# Altium project OZ440-SE100-CAR003.PrjPcb (part 1 of 3)
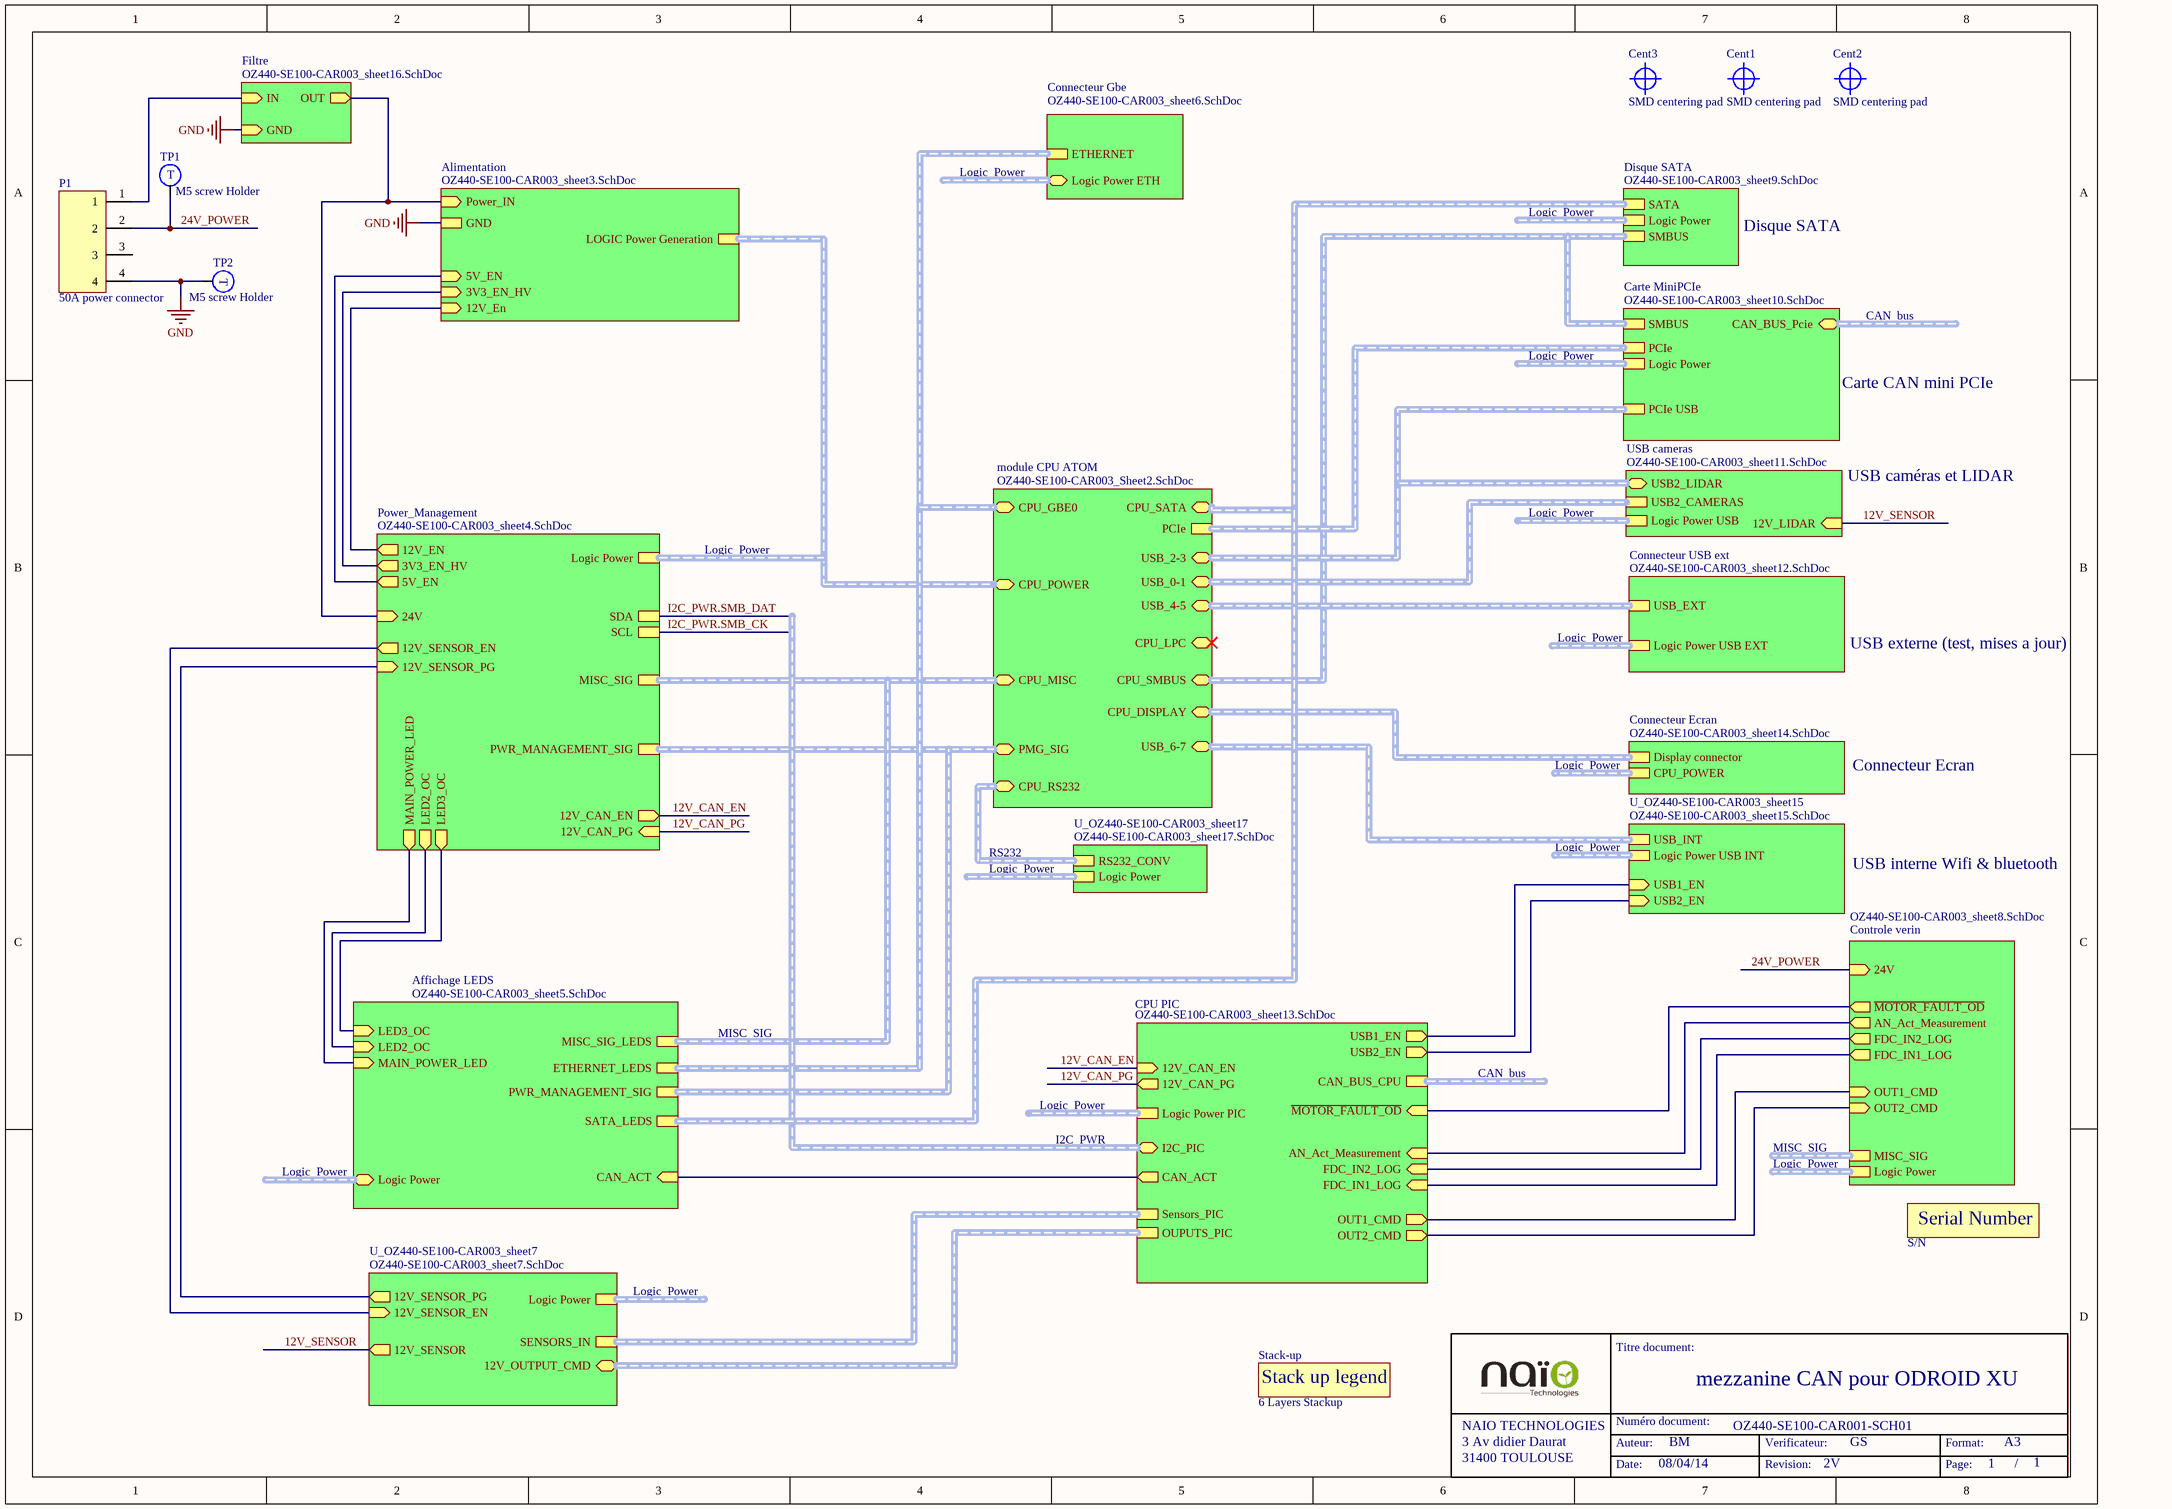
[diagram p0: OZ440-SE100-CAR003_Sheet1.SchDoc]
AssyDocumentNumber: OZ440-SE100-CAR003-Asb01; BoardName: Carte Mere OZ440; BoardPartNumber: OZ440-SE100-CAR003_2V; BoardRevision: 2V; DesignEngineer: Bruno M; DrillDocumentNumber: OZ440-SE100-CAR003-DRL01; ProjectTitle: Carte Mere OZ440; VerifEngineer: Pascal S
17 sheets, 326 parts. Net scope: strictly hierarchical (ports join the sheet entries above them; power ports are local).
Board file: OZ440-SE100-CAR003.PcbDoc
Sheets:
  OZ440-SE100-CAR003_Sheet1.SchDoc
    module CPU ATOM = OZ440-SE100-CAR003_Sheet2.SchDoc
    Alimentation = OZ440-SE100-CAR003_sheet3.SchDoc
    Power_Management = OZ440-SE100-CAR003_sheet4.SchDoc
    Affichage LEDS = OZ440-SE100-CAR003_sheet5.SchDoc
    Connecteur Gbe = OZ440-SE100-CAR003_sheet6.SchDoc
    U_OZ440-SE100-CAR003_sheet7 = OZ440-SE100-CAR003_sheet7.SchDoc
    Controle verin = OZ440-SE100-CAR003_sheet8.SchDoc
    Disque SATA = OZ440-SE100-CAR003_sheet9.SchDoc
    Carte MiniPCIe = OZ440-SE100-CAR003_sheet10.SchDoc
    USB cameras = OZ440-SE100-CAR003_sheet11.SchDoc
    Connecteur USB ext = OZ440-SE100-CAR003_sheet12.SchDoc
    CPU PIC = OZ440-SE100-CAR003_sheet13.SchDoc
    Connecteur Ecran = OZ440-SE100-CAR003_sheet14.SchDoc
    U_OZ440-SE100-CAR003_sheet15 = OZ440-SE100-CAR003_sheet15.SchDoc
    Filtre = OZ440-SE100-CAR003_sheet16.SchDoc
    U_OZ440-SE100-CAR003_sheet17 = OZ440-SE100-CAR003_sheet17.SchDoc

## Sheet OZ440-SE100-CAR003_Sheet1.SchDoc: mezzanine CAN pour ODROID XU
size A3; Date: 08/04/14; CheckedBy: GS; Author: BM; DocumentNumber: OZ440-SE100-CAR001-SCH01; Revision: 2V; SheetNumber: 1; SheetTotal: 1

### Parts
Cent1  MEC-STD-CENTER  [MEC-STD-CENTER]  (value not drawn)  (no BOM)
Cent2  MEC-STD-CENTER  [MEC-STD-CENTER]  (value not drawn)  (no BOM)
Cent3  MEC-STD-CENTER  [MEC-STD-CENTER]  (value not drawn)  (no BOM)
P1  Displayed reference: 50A power connector  [CONN-SPE-428204213_MOLEX]  (hidden comment: CONN-STD-4P_puissance)
SN1  Displayed reference: S/N  [SERIAL_NUMBER-STD]  (hidden comment: SERIAL-NUMBER)
Stack-up  Displayed reference: 6 Layers Stackup  [STACKUP-SPE-6LAYERS]  (hidden comment: STACKUP)  (no BOM)
TP1  Displayed reference: M5 screw Holder  [MEC-SPE-WURTHZ_7460408]  (hidden comment: TP-STD-TEST_POINT)
TP2  Displayed reference: M5 screw Holder  [MEC-SPE-WURTHZ_7460408]  (hidden comment: TP-STD-TEST_POINT)

### Sub-sheets
Affichage LEDS = OZ440-SE100-CAR003_sheet5.SchDoc: SATA_LEDS (harness SATA), ETHERNET_LEDS (harness ETHERNET), MISC_SIG_LEDS (harness MISC_SIG), MAIN_POWER_LED (in), PWR_MANAGEMENT_SIG (harness PWR_MANAGEMENT_SIG), CAN_ACT (in), LED2_OC (in), LED3_OC (in), Logic Power (harness Logic Power)
Alimentation = OZ440-SE100-CAR003_sheet3.SchDoc: Power_IN (in), 12V_En (in), GND, 5V_EN (in), LOGIC Power Generation (harness Logic Power), 3V3_EN_HV (in)
Carte MiniPCIe = OZ440-SE100-CAR003_sheet10.SchDoc: PCIe (harness PCIe), Logic Power (harness Logic Power), SMBUS (harness SMBUS), PCIe USB (harness USB2_DUAL), CAN_BUS_Pcie (harness CAN_BUS)
Connecteur Ecran = OZ440-SE100-CAR003_sheet14.SchDoc: Display connector (harness Display), CPU_POWER (harness Logic Power)
Connecteur Gbe = OZ440-SE100-CAR003_sheet6.SchDoc: ETHERNET (harness ETHERNET), Logic Power ETH (harness Logic Power)
Connecteur USB ext = OZ440-SE100-CAR003_sheet12.SchDoc: USB_EXT (harness USB2_DUAL), Logic Power USB EXT (harness Logic Power)
Controle verin = OZ440-SE100-CAR003_sheet8.SchDoc: 24V (in), OUT1_CMD (in), OUT2_CMD (in), MISC_SIG (harness MISC_SIG), ~{MOTOR_FAULT_OD} (out), Logic Power (harness Logic Power), AN_Act_Measurement (out), FDC_IN2_LOG (out), FDC_IN1_LOG (out)
CPU PIC = OZ440-SE100-CAR003_sheet13.SchDoc: CAN_BUS_CPU (harness CAN_BUS), Logic Power PIC (harness Logic Power), OUPUTS_PIC (harness OUPUTS), Sensors_PIC (harness Sensors), OUT1_CMD (out), OUT2_CMD (out), AN_Act_Measurement (in), FDC_IN2_LOG (in), FDC_IN1_LOG (in), ~{MOTOR_FAULT_OD} (in), I2C_PIC (harness SMBUS), CAN_ACT (out), 12V_CAN_EN (in), 12V_CAN_PG (out), USB1_EN (out), USB2_EN (out)
Disque SATA = OZ440-SE100-CAR003_sheet9.SchDoc: SATA (harness SATA), Logic Power (harness Logic Power), SMBUS (harness SMBUS)
Filtre = OZ440-SE100-CAR003_sheet16.SchDoc: IN (in), OUT (out), GND (in)
module CPU ATOM = OZ440-SE100-CAR003_Sheet2.SchDoc: PCIe (harness PCIe), CPU_POWER (harness Logic Power), CPU_DISPLAY (harness Display), CPU_GBE0 (harness ETHERNET), USB_0-1 (harness USB2_DUAL), USB_2-3 (harness USB2_DUAL), CPU_SATA (harness SATA), CPU_LPC (harness LPC_BUS), PMG_SIG (harness PWR_MANAGEMENT_SIG), CPU_MISC (harness MISC_SIG), CPU_RS232 (harness RS232), CPU_SMBUS (harness SMBUS), USB_4-5 (harness USB2_DUAL), USB_6-7 (harness USB2_DUAL)
Power_Management = OZ440-SE100-CAR003_sheet4.SchDoc: Logic Power (harness Logic Power), SCL, SDA, 24V (in), PWR_MANAGEMENT_SIG (harness PWR_MANAGEMENT_SIG), MISC_SIG (harness MISC_SIG), 3V3_EN_HV (out), 12V_EN (out), 5V_EN (out), 12V_SENSOR_EN (out), 12V_CAN_EN (out), MAIN_POWER_LED (out), LED2_OC (out), LED3_OC (out), 12V_SENSOR_PG (in), 12V_CAN_PG (in)
U_OZ440-SE100-CAR003_sheet7 = OZ440-SE100-CAR003_sheet7.SchDoc: Logic Power (harness Logic Power), 12V_SENSOR_EN (in), 12V_SENSOR_PG (out), SENSORS_IN (harness Sensors), 12V_OUTPUT_CMD (harness OUPUTS), 12V_SENSOR (out)
U_OZ440-SE100-CAR003_sheet15 = OZ440-SE100-CAR003_sheet15.SchDoc: USB_INT (harness USB2_DUAL), Logic Power USB INT (harness Logic Power), USB1_EN (in), USB2_EN (in)
U_OZ440-SE100-CAR003_sheet17 = OZ440-SE100-CAR003_sheet17.SchDoc: RS232_CONV (harness RS232), Logic Power (harness Logic Power)
USB cameras = OZ440-SE100-CAR003_sheet11.SchDoc: Logic Power USB (harness Logic Power), USB2_CAMERAS (harness USB2_DUAL), USB2_LIDAR (harness USB2_DUAL), 12V_LIDAR (in)

### Nets
12V_SENSOR: sheet U_OZ440-SE100-CAR003_sheet7/12V_SENSOR, sheet USB cameras/12V_LIDAR
GND: P1.4 TP2.1(T) ; sheet Alimentation/GND, sheet Filtre/GND  [project net Logic_Power.GND]
5V_EN: sheet Alimentation/5V_EN, sheet Power_Management/5V_EN
12V_CAN_EN: sheet Power_Management/12V_CAN_EN, sheet CPU PIC/12V_CAN_EN
12V_CAN_PG: sheet Power_Management/12V_CAN_PG, sheet CPU PIC/12V_CAN_PG
12V_EN: sheet Alimentation/12V_En, sheet Power_Management/12V_EN
12V_SENSOR_EN: sheet Power_Management/12V_SENSOR_EN, sheet U_OZ440-SE100-CAR003_sheet7/12V_SENSOR_EN
24V_POWER: P1.2 TP1.1(T) ; sheet Controle verin/24V
~{MOTOR_FAULT_OD}: sheet Controle verin/~{MOTOR_FAULT_OD}, sheet CPU PIC/~{MOTOR_FAULT_OD}
CAN_ACT: sheet Affichage LEDS/CAN_ACT, sheet CPU PIC/CAN_ACT
LED2_OC: sheet Power_Management/LED2_OC, sheet Affichage LEDS/LED2_OC
LED3_OC: sheet Power_Management/LED3_OC, sheet Affichage LEDS/LED3_OC
MAIN_POWER_LED: sheet Power_Management/MAIN_POWER_LED, sheet Affichage LEDS/MAIN_POWER_LED
POWER_IN: sheet Alimentation/Power_IN, sheet Power_Management/24V, sheet Filtre/OUT
NetC51_2: sheet Controle verin/AN_Act_Measurement, sheet CPU PIC/AN_Act_Measurement
NetC52_2: sheet Controle verin/FDC_IN1_LOG, sheet CPU PIC/FDC_IN1_LOG
NetC53_2: sheet Controle verin/FDC_IN2_LOG, sheet CPU PIC/FDC_IN2_LOG
NetF6_1: P1.1 ; sheet Filtre/IN
NetQ1_4: sheet Alimentation/3V3_EN_HV, sheet Power_Management/3V3_EN_HV
NetQ28_1: sheet CPU PIC/USB1_EN, sheet U_OZ440-SE100-CAR003_sheet15/USB1_EN
NetQ29_1: sheet CPU PIC/USB2_EN, sheet U_OZ440-SE100-CAR003_sheet15/USB2_EN
NetR42_2: sheet Power_Management/12V_SENSOR_PG, sheet U_OZ440-SE100-CAR003_sheet7/12V_SENSOR_PG
NetR83_1: sheet Controle verin/OUT1_CMD, sheet CPU PIC/OUT1_CMD
NetR84_1: sheet Controle verin/OUT2_CMD, sheet CPU PIC/OUT2_CMD

Not connected (* = marked no-connect by the designer): P1 3

### Buses and harness runs
harness CAN_bus = sheet Carte MiniPCIe/CAN_BUS_Pcie
harness CAN_bus = sheet CPU PIC/CAN_BUS_CPU
harness I2C_PWR = sheet CPU PIC/I2C_PIC
harness Logic_Power = sheet Affichage LEDS/Logic Power
harness Logic_Power = sheet Alimentation/LOGIC Power Generation = sheet module CPU ATOM/CPU_POWER = sheet Power_Management/Logic Power
harness Logic_Power = sheet Carte MiniPCIe/Logic Power
harness Logic_Power = sheet Connecteur Ecran/CPU_POWER
harness Logic_Power = sheet Connecteur Gbe/Logic Power ETH
harness Logic_Power = sheet Connecteur USB ext/Logic Power USB EXT
harness Logic_Power = sheet Controle verin/Logic Power
harness Logic_Power = sheet CPU PIC/Logic Power PIC
harness Logic_Power = sheet Disque SATA/Logic Power
harness Logic_Power = sheet U_OZ440-SE100-CAR003_sheet7/Logic Power
harness Logic_Power = sheet U_OZ440-SE100-CAR003_sheet15/Logic Power USB INT
harness Logic_Power = sheet U_OZ440-SE100-CAR003_sheet17/Logic Power
harness Logic_Power = sheet USB cameras/Logic Power USB
harness MISC_SIG = sheet Affichage LEDS/MISC_SIG_LEDS = sheet module CPU ATOM/CPU_MISC = sheet Power_Management/MISC_SIG
harness MISC_SIG = sheet Controle verin/MISC_SIG
harness RS232 = sheet module CPU ATOM/CPU_RS232 = sheet U_OZ440-SE100-CAR003_sheet17/RS232_CONV
harness sheet Affichage LEDS/ETHERNET_LEDS = sheet Connecteur Gbe/ETHERNET = sheet module CPU ATOM/CPU_GBE0
harness sheet Affichage LEDS/PWR_MANAGEMENT_SIG = sheet module CPU ATOM/PMG_SIG = sheet Power_Management/PWR_MANAGEMENT_SIG
harness sheet Affichage LEDS/SATA_LEDS = sheet Disque SATA/SATA = sheet module CPU ATOM/CPU_SATA
harness sheet Carte MiniPCIe/PCIe = sheet module CPU ATOM/PCIe
harness sheet Carte MiniPCIe/PCIe USB = sheet module CPU ATOM/USB_2-3 = sheet USB cameras/USB2_LIDAR
harness sheet Carte MiniPCIe/SMBUS = sheet Disque SATA/SMBUS = sheet module CPU ATOM/CPU_SMBUS
harness sheet Connecteur Ecran/Display connector = sheet module CPU ATOM/CPU_DISPLAY
harness sheet Connecteur USB ext/USB_EXT = sheet module CPU ATOM/USB_4-5
harness sheet CPU PIC/OUPUTS_PIC = sheet U_OZ440-SE100-CAR003_sheet7/12V_OUTPUT_CMD
harness sheet CPU PIC/Sensors_PIC = sheet U_OZ440-SE100-CAR003_sheet7/SENSORS_IN
harness sheet module CPU ATOM/USB_0-1 = sheet USB cameras/USB2_CAMERAS
harness sheet module CPU ATOM/USB_6-7 = sheet U_OZ440-SE100-CAR003_sheet15/USB_INT

### Notes on the sheet
- Disque SATA
- Carte CAN mini PCIe
- USB caméras et LIDAR
- USB externe (test, mises a jour)
- Connecteur Ecran
- USB interne Wifi & bluetooth
- Titre document:
- NAIO TECHNOLOGIES
- 3 Av didier Daurat
- 31400 TOULOUSE
- Auteur:
- Numéro document:
- Verificateur:
- Format:
- A3
- Date:
- Revision:
- Page:
- /
- (in symbol 6 Layers Stackup) Stack up legend

### Library data of the parts
Cent1-Cent3 = SMD centering pad: Validated: False; Reference: SMD centering pad; Displayed reference: SMD centering pad
P1 = 42820-4213: 4 pin power connector, RA; Manufacturer: Molex; Max Voltage: 600V; Max Current: 50A; Validated: False; Reference: 42820-4213; Footprint description: Thu hole 10mm pitch, RA; Pin Count: 4; Rev: G7; helpURL: http://www.molex.com/pdm_docs/sd/428203213_sd.pdf; Supplier 1: Mouser; Supplier Part Number 1: 538-42820-4213; Supplier 2: Newark; Supplier Part Number 2: 92M0998
SN1 = Serial Number: serial number copper identification; Validated: False; Reference: Serial Number
Stack-up = 6 Layers Stackup: 6 Layers Stackup identification; Validated: False; Reference: 6 Layers Stackup
TP1 TP2 = 7460408: Bush with threaded hole M5; Manufacturer: WURTHZ; Max Current: 160A; Validated: False; Reference: 7460408; Material: CuZn39Pb3; Footprint description: Pressfit Bush with threaded hole M5; Pin Count: 1; helpURL: http://katalog.we-online.de/em/datasheet/7460408.pdf; Supplier 1: Farnell; Supplier Part Number 1: 1821279; Supplier 2: Mouser; Supplier Part Number 2: 710-7460408

## Sheet OZ440-SE100-CAR003_Sheet2.SchDoc
size A3
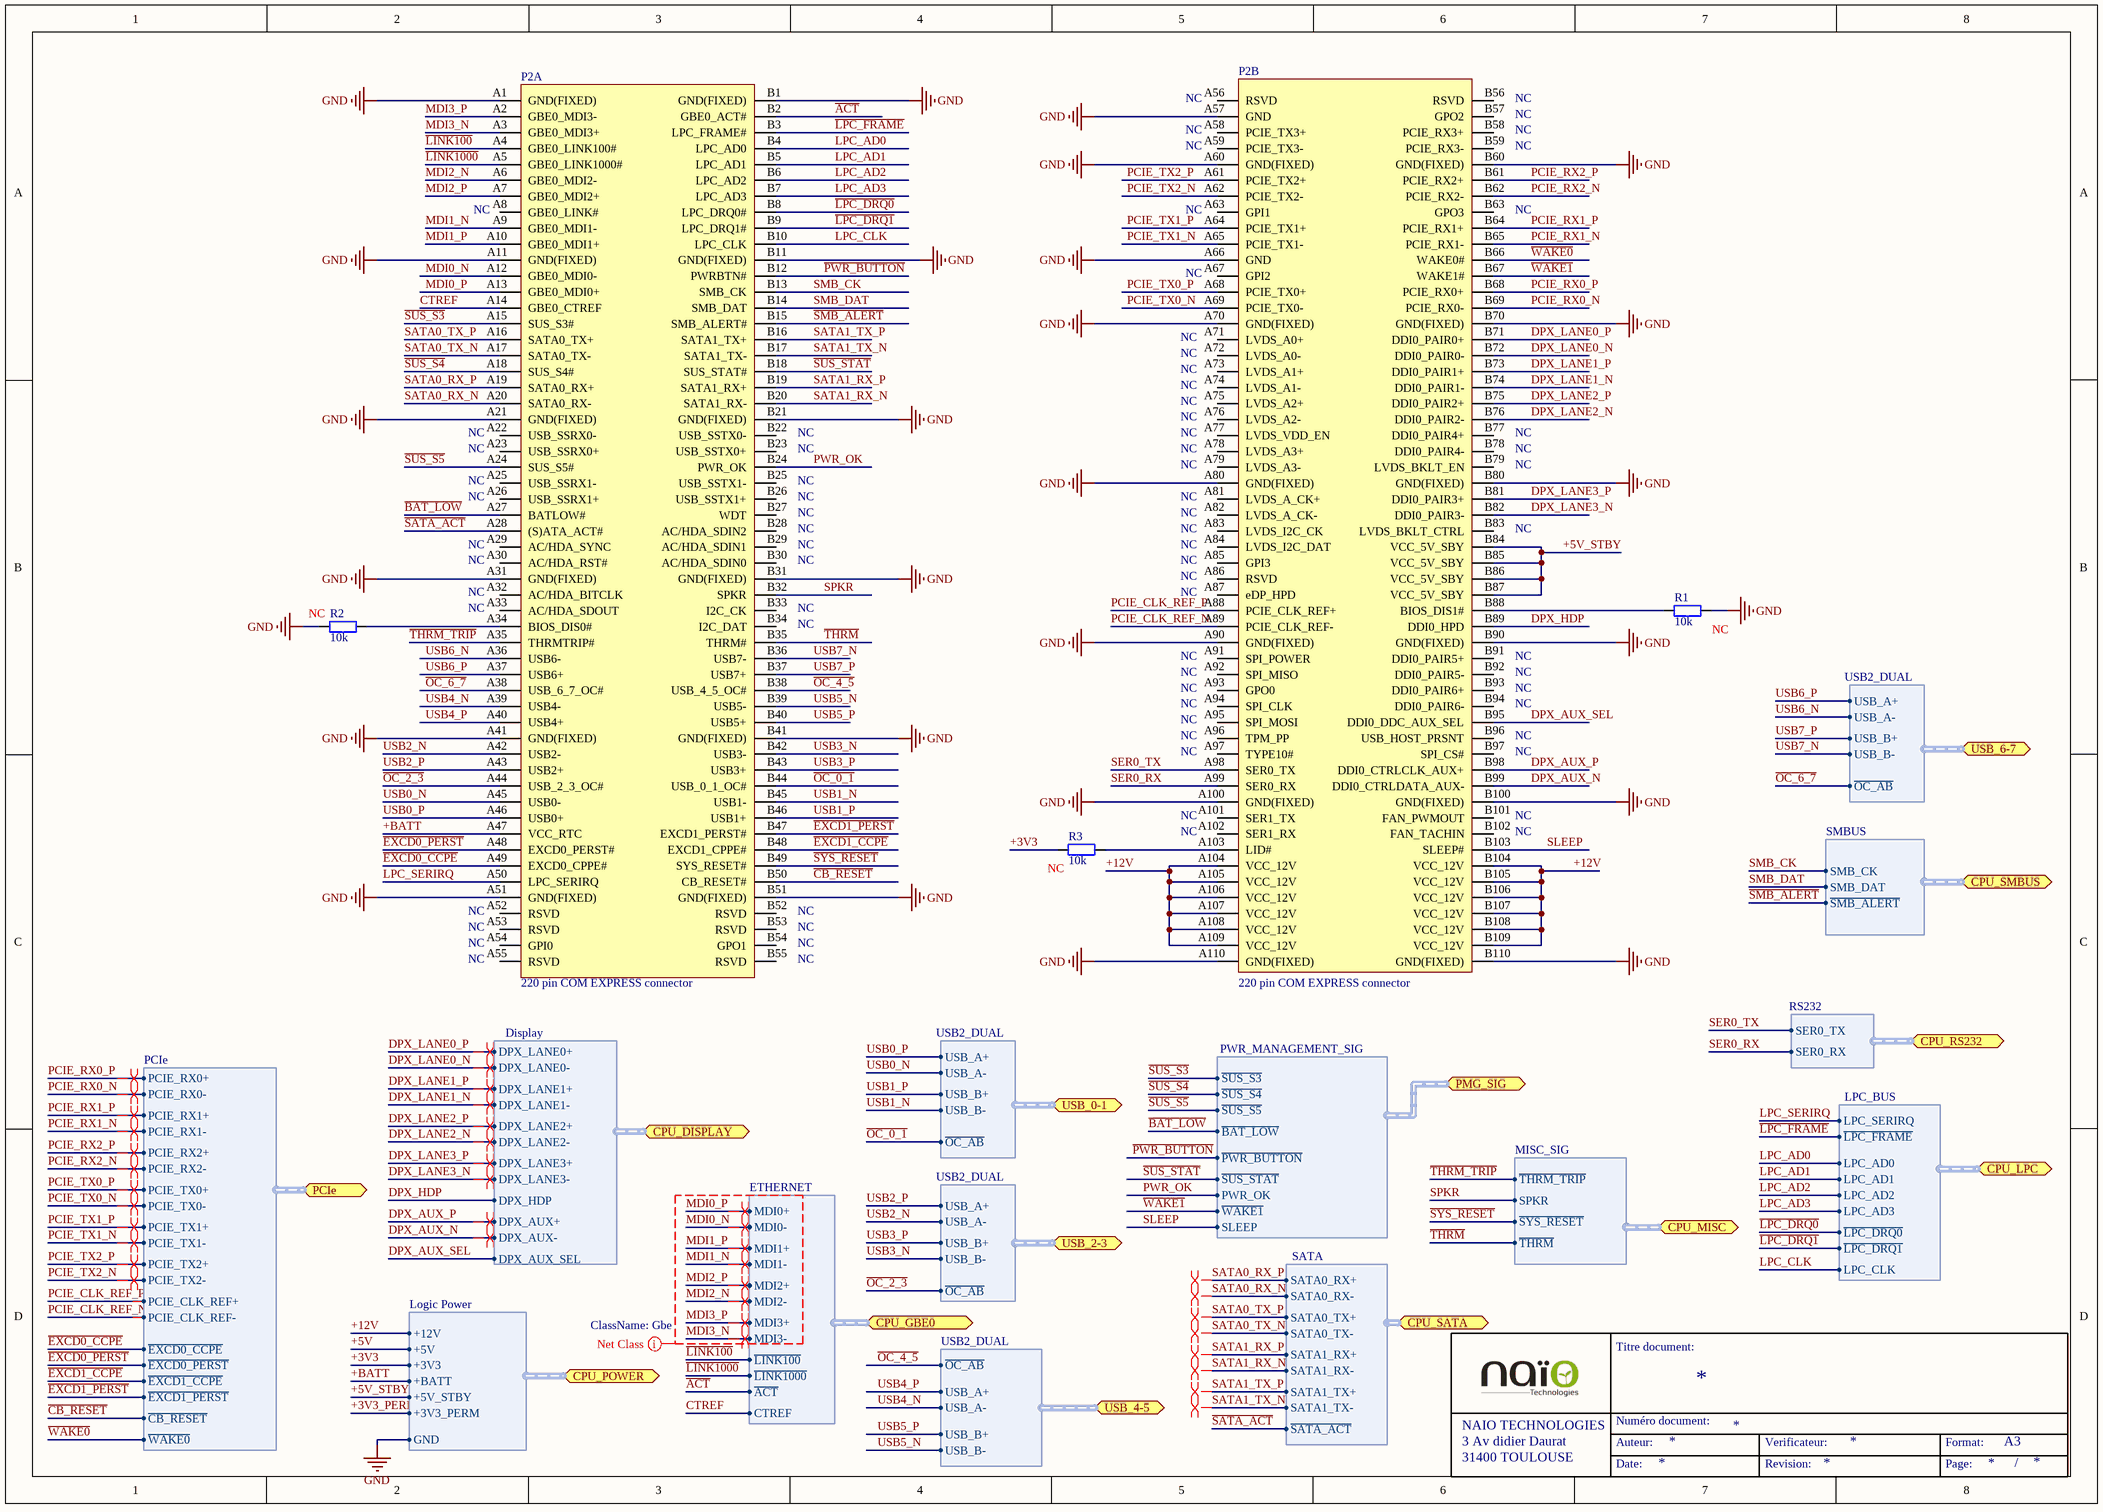
[diagram p1: OZ440-SE100-CAR003_Sheet2.SchDoc]

### Parts
P2  Displayed reference: 220 pin COM EXPRESS connector  [CONN-SPE_AMP_3-1827253-6]  (hidden comment: CONN-SPE-220P_AMP_3-1827253-6)  (parts A,B of 2)
R1  Displayed reference: 10k  [R0805-STD]  (hidden comment: RES-SMD)
R2  Displayed reference: 10k  [R0805-STD]  (hidden comment: RES-SMD)
R3  Displayed reference: 10k  [R0805-STD]  (hidden comment: RES-SMD)

### Ports
CPU_DISPLAY (harness Display), CPU_GBE0 (harness ETHERNET), CPU_LPC (harness LPC_BUS), CPU_MISC (harness MISC_SIG), CPU_POWER (harness Logic Power), CPU_RS232 (harness RS232), CPU_SATA (harness SATA), CPU_SMBUS (harness SMBUS), PCIe (harness PCIe), PMG_SIG (harness PWR_MANAGEMENT_SIG), USB_0-1 (harness USB2_DUAL), USB_2-3 (harness USB2_DUAL), USB_4-5 (harness USB2_DUAL), USB_6-7 (harness USB2_DUAL)

### Harnesses
PCIe: PCIE_RX0+, PCIE_RX0-, PCIE_RX1+, PCIE_RX1-, PCIE_RX2+, PCIE_RX2-, PCIE_TX0+, PCIE_TX0-, PCIE_TX1+, PCIE_TX1-, PCIE_TX2+, PCIE_TX2-, PCIE_CLK_REF+, PCIE_CLK_REF-, ~{EXCD0_CCPE}, ~{EXCD0_PERST}, ~{EXCD1_CCPE}, ~{EXCD1_PERST}, ~{CB_RESET}, ~{WAKE0}
Logic Power: +12V, +5V, +3V3, +BATT, +5V_STBY, GND, +3V3_PERM
Display: DPX_LANE0+, DPX_LANE0-, DPX_LANE1+, DPX_LANE1-, DPX_LANE2+, DPX_LANE2-, DPX_LANE3+, DPX_LANE3-, DPX_HDP, DPX_AUX+, DPX_AUX-, DPX_AUX_SEL
ETHERNET: MDI0+, MDI0-, MDI1+, MDI1-, MDI2+, MDI2-, MDI3+, MDI3-, ~{LINK100}, ~{LINK1000}, ~{ACT}, CTREF
USB2_DUAL: USB_A+, USB_A-, USB_B+, USB_B-, ~{OC_AB}
USB2_DUAL: ~{OC_AB}, USB_A-, USB_A+, USB_B-, USB_B+
SATA: SATA0_RX+, SATA0_RX-, SATA0_TX+, SATA0_TX-, SATA1_RX+, SATA1_RX-, SATA1_TX+, SATA1_TX-, ~{SATA_ACT}
PWR_MANAGEMENT_SIG: ~{SUS_S3}, ~{SUS_S4}, ~{SUS_S5}, ~{BAT_LOW}, ~{PWR_BUTTON}, ~{SUS_STAT}, PWR_OK, ~{WAKE1}, SLEEP
MISC_SIG: ~{THRM_TRIP}, SPKR, ~{SYS_RESET}, ~{THRM}
LPC_BUS: LPC_SERIRQ, ~{LPC_FRAME}, LPC_AD0, LPC_AD1, LPC_AD2, LPC_AD3, ~{LPC_DRQ0}, ~{LPC_DRQ1}, LPC_CLK
RS232: SER0_TX, SER0_RX
SMBUS: SMB_CK, SMB_DAT, ~{SMB_ALERT}

### Nets
+3V3: R3.2 ; port CPU_POWER.+3V3
+5V: P2.B84(VCC_5V_SBY) P2.B85(VCC_5V_SBY) P2.B86(VCC_5V_SBY) P2.B87(VCC_5V_SBY) ; port CPU_POWER.+5V, port CPU_POWER.+5V_STBY  [also labelled +5V_STBY]
GND: P2.A1(GND(FIXED)) P2.A11(GND(FIXED)) P2.A21(GND(FIXED)) P2.A31(GND(FIXED)) P2.A41(GND(FIXED)) P2.A51(GND(FIXED)) P2.A57(GND) P2.A60(GND(FIXED)) P2.A66(GND) P2.A70(GND(FIXED)) P2.A80(GND(FIXED)) P2.A90(GND(FIXED)) P2.A100(GND(FIXED)) P2.A110(GND(FIXED)) P2.B1(GND(FIXED)) P2.B11(GND(FIXED)) P2.B21(GND(FIXED)) P2.B31(GND(FIXED)) P2.B41(GND(FIXED)) P2.B51(GND(FIXED)) P2.B60(GND(FIXED)) P2.B70(GND(FIXED)) P2.B80(GND(FIXED)) P2.B90(GND(FIXED)) P2.B100(GND(FIXED)) P2.B110(GND(FIXED)) R1.1 R2.1 ; port CPU_POWER.GND  [project net Logic_Power.GND]
+12V: P2.A104(VCC_12V) P2.A105(VCC_12V) P2.A106(VCC_12V) P2.A107(VCC_12V) P2.A108(VCC_12V) P2.A109(VCC_12V) P2.B104(VCC_12V) P2.B105(VCC_12V) P2.B106(VCC_12V) P2.B107(VCC_12V) P2.B108(VCC_12V) P2.B109(VCC_12V) ; port CPU_POWER.+12V
+BATT: P2.A47(VCC_RTC) ; port CPU_POWER.+BATT
~{ACT}: P2.B2(GBE0_ACT#) ; port CPU_GBE0.~{ACT}
~{BAT_LOW}: P2.A27(BATLOW#) ; port PMG_SIG.~{BAT_LOW}
~{CB_RESET}: P2.B50(CB_RESET#) ; port PCIe.~{CB_RESET}
~{EXCD0_CCPE}: P2.A49(EXCD0_CPPE#) ; port PCIe.~{EXCD0_CCPE}
~{EXCD0_PERST}: P2.A48(EXCD0_PERST#) ; port PCIe.~{EXCD0_PERST}
~{EXCD1_CCPE}: P2.B48(EXCD1_CPPE#) ; port PCIe.~{EXCD1_CCPE}
~{EXCD1_PERST}: P2.B47(EXCD1_PERST#) ; port PCIe.~{EXCD1_PERST}
~{LINK100}: P2.A4(GBE0_LINK100#) ; port CPU_GBE0.~{LINK100}
~{LINK1000}: P2.A5(GBE0_LINK1000#) ; port CPU_GBE0.~{LINK1000}
~{LPC_DRQ0}: P2.B8(LPC_DRQ0#) ; port CPU_LPC.~{LPC_DRQ0}
~{LPC_DRQ1}: P2.B9(LPC_DRQ1#) ; port CPU_LPC.~{LPC_DRQ1}
~{LPC_FRAME}: P2.B3(LPC_FRAME#) ; port CPU_LPC.~{LPC_FRAME}
~{OC_0_1}: P2.B44(USB_0_1_OC#) ; port USB_0-1.~{OC_AB}
~{OC_2_3}: P2.A44(USB_2_3_OC#) ; port USB_2-3.~{OC_AB}
~{OC_4_5}: P2.B38(USB_4_5_OC#) ; port USB_4-5.~{OC_AB}
~{OC_6_7}: P2.A38(USB_6_7_OC#) ; port USB_6-7.~{OC_AB}
~{PWR_BUTTON}: P2.B12(PWRBTN#) ; port PMG_SIG.~{PWR_BUTTON}
~{SATA_ACT}: P2.A28((S)ATA_ACT#) ; port CPU_SATA.~{SATA_ACT}
~{SMB_ALERT}: P2.B15(SMB_ALERT#) ; port CPU_SMBUS.~{SMB_ALERT}
~{SUS_S3}: P2.A15(SUS_S3#) ; port PMG_SIG.~{SUS_S3}
~{SUS_S4}: P2.A18(SUS_S4#) ; port PMG_SIG.~{SUS_S4}
~{SUS_S5}: P2.A24(SUS_S5#) ; port PMG_SIG.~{SUS_S5}  [project net ~{SOFT_OFF}]
~{SUS_STAT}: P2.B18(SUS_STAT#) ; port PMG_SIG.~{SUS_STAT}
~{SYS_RESET}: P2.B49(SYS_RESET#) ; port CPU_MISC.~{SYS_RESET}
~{THRM}: P2.B35(THRM#) ; port CPU_MISC.~{THRM}
~{THRM_TRIP}: P2.A35(THRMTRIP#) ; port CPU_MISC.~{THRM_TRIP}
~{WAKE0}: P2.B66(WAKE0#) ; port PCIe.~{WAKE0}
~{WAKE1}: P2.B67(WAKE1#) ; port PMG_SIG.~{WAKE1}
CTREF: P2.A14(GBE0_CTREF) ; port CPU_GBE0.CTREF
DPX_AUX_N: P2.B99(DDI0_CTRLDATA_AUX-) ; port CPU_DISPLAY.DPX_AUX-
DPX_AUX_P: P2.B98(DDI0_CTRLCLK_AUX+) ; port CPU_DISPLAY.DPX_AUX+
DPX_AUX_SEL: P2.B95(DDI0_DDC_AUX_SEL) ; port CPU_DISPLAY.DPX_AUX_SEL
DPX_HDP: P2.B89(DDI0_HPD) ; port CPU_DISPLAY.DPX_HDP
DPX_LANE0_N: P2.B72(DDI0_PAIR0-) ; port CPU_DISPLAY.DPX_LANE0-
DPX_LANE0_P: P2.B71(DDI0_PAIR0+) ; port CPU_DISPLAY.DPX_LANE0+
DPX_LANE1_N: P2.B74(DDI0_PAIR1-) ; port CPU_DISPLAY.DPX_LANE1-
DPX_LANE1_P: P2.B73(DDI0_PAIR1+) ; port CPU_DISPLAY.DPX_LANE1+
DPX_LANE2_N: P2.B76(DDI0_PAIR2-) ; port CPU_DISPLAY.DPX_LANE2-
DPX_LANE2_P: P2.B75(DDI0_PAIR2+) ; port CPU_DISPLAY.DPX_LANE2+
DPX_LANE3_N: P2.B82(DDI0_PAIR3-) ; port CPU_DISPLAY.DPX_LANE3-
DPX_LANE3_P: P2.B81(DDI0_PAIR3+) ; port CPU_DISPLAY.DPX_LANE3+
LPC_AD0: P2.B4(LPC_AD0) ; port CPU_LPC.LPC_AD0
LPC_AD1: P2.B5(LPC_AD1) ; port CPU_LPC.LPC_AD1
LPC_AD2: P2.B6(LPC_AD2) ; port CPU_LPC.LPC_AD2
LPC_AD3: P2.B7(LPC_AD3) ; port CPU_LPC.LPC_AD3
LPC_CLK: P2.B10(LPC_CLK) ; port CPU_LPC.LPC_CLK
LPC_SERIRQ: P2.A50(LPC_SERIRQ) ; port CPU_LPC.LPC_SERIRQ
MDI0_N: P2.A12(GBE0_MDI0-) ; port CPU_GBE0.MDI0-
MDI0_P: P2.A13(GBE0_MDI0+) ; port CPU_GBE0.MDI0+
MDI1_N: P2.A9(GBE0_MDI1-) ; port CPU_GBE0.MDI1-
MDI1_P: P2.A10(GBE0_MDI1+) ; port CPU_GBE0.MDI1+
MDI2_N: P2.A6(GBE0_MDI2-) ; port CPU_GBE0.MDI2-
MDI2_P: P2.A7(GBE0_MDI2+) ; port CPU_GBE0.MDI2+
MDI3_N: P2.A3(GBE0_MDI3+) ; port CPU_GBE0.MDI3-
MDI3_P: P2.A2(GBE0_MDI3-) ; port CPU_GBE0.MDI3+
PCIE_CLK_REF_N: P2.A89(PCIE_CLK_REF-) ; port PCIe.PCIE_CLK_REF-
PCIE_CLK_REF_P: P2.A88(PCIE_CLK_REF+) ; port PCIe.PCIE_CLK_REF+
PCIE_RX0_N: P2.B69(PCIE_RX0-) ; port PCIe.PCIE_RX0-
PCIE_RX0_P: P2.B68(PCIE_RX0+) ; port PCIe.PCIE_RX0+
PCIE_RX1_N: P2.B65(PCIE_RX1-) ; port PCIe.PCIE_RX1-
PCIE_RX1_P: P2.B64(PCIE_RX1+) ; port PCIe.PCIE_RX1+
PCIE_RX2_N: P2.B62(PCIE_RX2-) ; port PCIe.PCIE_RX2-
PCIE_RX2_P: P2.B61(PCIE_RX2+) ; port PCIe.PCIE_RX2+
PCIE_TX0_N: P2.A69(PCIE_TX0-) ; port PCIe.PCIE_TX0-
PCIE_TX0_P: P2.A68(PCIE_TX0+) ; port PCIe.PCIE_TX0+
PCIE_TX1_N: P2.A65(PCIE_TX1-) ; port PCIe.PCIE_TX1-
PCIE_TX1_P: P2.A64(PCIE_TX1+) ; port PCIe.PCIE_TX1+
PCIE_TX2_N: P2.A62(PCIE_TX2-) ; port PCIe.PCIE_TX2-
PCIE_TX2_P: P2.A61(PCIE_TX2+) ; port PCIe.PCIE_TX2+
PWR_OK: P2.B24(PWR_OK) ; port PMG_SIG.PWR_OK
SATA0_RX_N: P2.A20(SATA0_RX-) ; port CPU_SATA.SATA0_RX-
SATA0_RX_P: P2.A19(SATA0_RX+) ; port CPU_SATA.SATA0_RX+
SATA0_TX_N: P2.A17(SATA0_TX-) ; port CPU_SATA.SATA0_TX-
SATA0_TX_P: P2.A16(SATA0_TX+) ; port CPU_SATA.SATA0_TX+
SATA1_RX_N: P2.B20(SATA1_RX-) ; port CPU_SATA.SATA1_RX-
SATA1_RX_P: P2.B19(SATA1_RX+) ; port CPU_SATA.SATA1_RX+
SATA1_TX_N: P2.B17(SATA1_TX-) ; port CPU_SATA.SATA1_TX-
SATA1_TX_P: P2.B16(SATA1_TX+) ; port CPU_SATA.SATA1_TX+
SER0_RX: P2.A99(SER0_RX) ; port CPU_RS232.SER0_RX  [project net RS232.SER0_RX]
SER0_TX: P2.A98(SER0_TX) ; port CPU_RS232.SER0_TX  [project net RS232.SER0_TX]
SLEEP: P2.B103(SLEEP#) ; port PMG_SIG.SLEEP
SMB_CK: P2.B13(SMB_CK) ; port CPU_SMBUS.SMB_CK
SMB_DAT: P2.B14(SMB_DAT) ; port CPU_SMBUS.SMB_DAT
SPKR: P2.B32(SPKR) ; port CPU_MISC.SPKR  [project net MISC_SIG.SPKR]
USB0_N: P2.A45(USB0-) ; port USB_0-1.USB_A-
USB0_P: P2.A46(USB0+) ; port USB_0-1.USB_A+
USB1_N: P2.B45(USB1-) ; port USB_0-1.USB_B-
USB1_P: P2.B46(USB1+) ; port USB_0-1.USB_B+
USB2_N: P2.A42(USB2-) ; port USB_2-3.USB_A-  [project net PCIe_USB_N]
USB2_P: P2.A43(USB2+) ; port USB_2-3.USB_A+  [project net PCIe_USB_P]
USB3_N: P2.B42(USB3-) ; port USB_2-3.USB_B-
USB3_P: P2.B43(USB3+) ; port USB_2-3.USB_B+
USB4_N: P2.A39(USB4-) ; port USB_4-5.USB_A-
USB4_P: P2.A40(USB4+) ; port USB_4-5.USB_A+
USB5_N: P2.B39(USB5-) ; port USB_4-5.USB_B-
USB5_P: P2.B40(USB5+) ; port USB_4-5.USB_B+
USB6_N: P2.A36(USB6-) ; port USB_6-7.USB_A-
USB6_P: P2.A37(USB6+) ; port USB_6-7.USB_A+
USB7_N: P2.B36(USB7-) ; port USB_6-7.USB_B-
USB7_P: P2.B37(USB7+) ; port USB_6-7.USB_B+
NetP2_A34: P2.A34(BIOS_DIS0#) R2.2
NetP2_A103: P2.A103(LID#) R3.1
NetP2_B88: P2.B88(BIOS_DIS1#) R1.2

Not connected (* = marked no-connect by the designer): P2 A8(GBE0_LINK#) A22(USB_SSRX0-) A23(USB_SSRX0+) A25(USB_SSRX1-) A26(USB_SSRX1+) A29(AC/HDA_SYNC) A30(AC/HDA_RST#) A32(AC/HDA_BITCLK) A33(AC/HDA_SDOUT) A52(RSVD) A53(RSVD) A54(GPI0) A55(RSVD) A56(RSVD) A58(PCIE_TX3+) A59(PCIE_TX3-) A63(GPI1) A67(GPI2) A71(LVDS_A0+) A72(LVDS_A0-) A73(LVDS_A1+) A74(LVDS_A1-) A75(LVDS_A2+) A76(LVDS_A2-) A77(LVDS_VDD_EN) A78(LVDS_A3+) A79(LVDS_A3-) A81(LVDS_A_CK+) A82(LVDS_A_CK-) A83(LVDS_I2C_CK) A84(LVDS_I2C_DAT) A85(GPI3) A86(RSVD) A87(eDP_HPD) A91(SPI_POWER) A92(SPI_MISO) A93(GPO0) A94(SPI_CLK) A95(SPI_MOSI) A96(TPM_PP) A97(TYPE10#) A101(SER1_TX) A102(SER1_RX) B22(USB_SSTX0-) B23(USB_SSTX0+) B25(USB_SSTX1-) B26(USB_SSTX1+) B27(WDT) B28(AC/HDA_SDIN2) B29(AC/HDA_SDIN1) B30(AC/HDA_SDIN0) B33(I2C_CK) B34(I2C_DAT) B52(RSVD) B53(RSVD) B54(GPO1) B55(RSVD) B56(RSVD) B57(GPO2) B58(PCIE_RX3+) B59(PCIE_RX3-) B63(GPO3) B77(DDI0_PAIR4+) B78(DDI0_PAIR4-) B79(LVDS_BKLT_EN) B83(LVDS_BKLT_CTRL) B91(DDI0_PAIR5+) B92(DDI0_PAIR5-) B93(DDI0_PAIR6+) B94(DDI0_PAIR6-) B96(USB_HOST_PRSNT) B97(SPI_CS#) B101(FAN_PWMOUT) B102(FAN_TACHIN)

### Layout directives
differential pair: DPX_AUX_N, DPX_AUX_P, DPX_LANE0_N, DPX_LANE0_P, DPX_LANE1_N, DPX_LANE1_P, DPX_LANE2_N, DPX_LANE2_P, DPX_LANE3_N, DPX_LANE3_P, MDI0_N, MDI0_P, MDI1_N, MDI1_P, MDI2_N, MDI2_P, MDI3_N, MDI3_P, PCIE_CLK_REF_N, PCIE_CLK_REF_P, PCIE_RX0_N, PCIE_RX0_P, PCIE_RX1_N, PCIE_RX1_P, PCIE_RX2_N, PCIE_RX2_P, PCIE_TX0_N, PCIE_TX0_P, PCIE_TX1_N, PCIE_TX1_P, PCIE_TX2_N, PCIE_TX2_P, SATA0_RX_N, SATA0_RX_P, SATA0_TX_N, SATA0_TX_P, SATA1_RX_N, SATA1_RX_P, SATA1_TX_N, SATA1_TX_P
net class Gbe: MDI0_N, MDI0_P, MDI1_N, MDI1_P, MDI2_N, MDI2_P, MDI3_N, MDI3_P

### Notes on the sheet
- (near P2) NC
- (near R2) NC
- (near R1) NC
- (near R3) NC
- Titre document:
- NAIO TECHNOLOGIES
- 3 Av didier Daurat
- 31400 TOULOUSE
- Auteur:
- Numéro document:
- Verificateur:
- Format:
- A3
- Date:
- Revision:
- Page:
- /

### Library data of the parts
P2 = 3-1827253-6: type 10 com express connector; Manufacturer: TE connectivity; Max Current: 1.5; Validated: False; Reference: 3-1827253-6; Footprint description: 220 pin SMD; Pin Count: 220; Rev: C; helpURL: http://www.te.com/catalog/pn/en/3-1827253-6; Supplier 1: Mouser; Supplier Part Number 1: 571-3-1827253-6; Supplier 2: Farnell; Supplier Part Number 2: 2059779
R1-R3 = CRCW080510K0FKxx: 10k Ohm 0805 SMD resistor; Manufacturer: Vishay; Value: 10 000; Tolerance: 1 %; Rated Power: 0,125 W; Validated: No; Reference: CRCW080510K0FKxx; Footprint description: standard 0805 SMD; Pin Count: 2; helpURL: http://www.vishay.com/docs/20035/dcrcwe3.pdf; Supplier 1: Farnell; Supplier Part Number 1: 1469856; Supplier 2: Mouser; Supplier Part Number 2: 71-CRCW0805-10K-E3

## Sheet OZ440-SE100-CAR003_sheet3.SchDoc
size A3
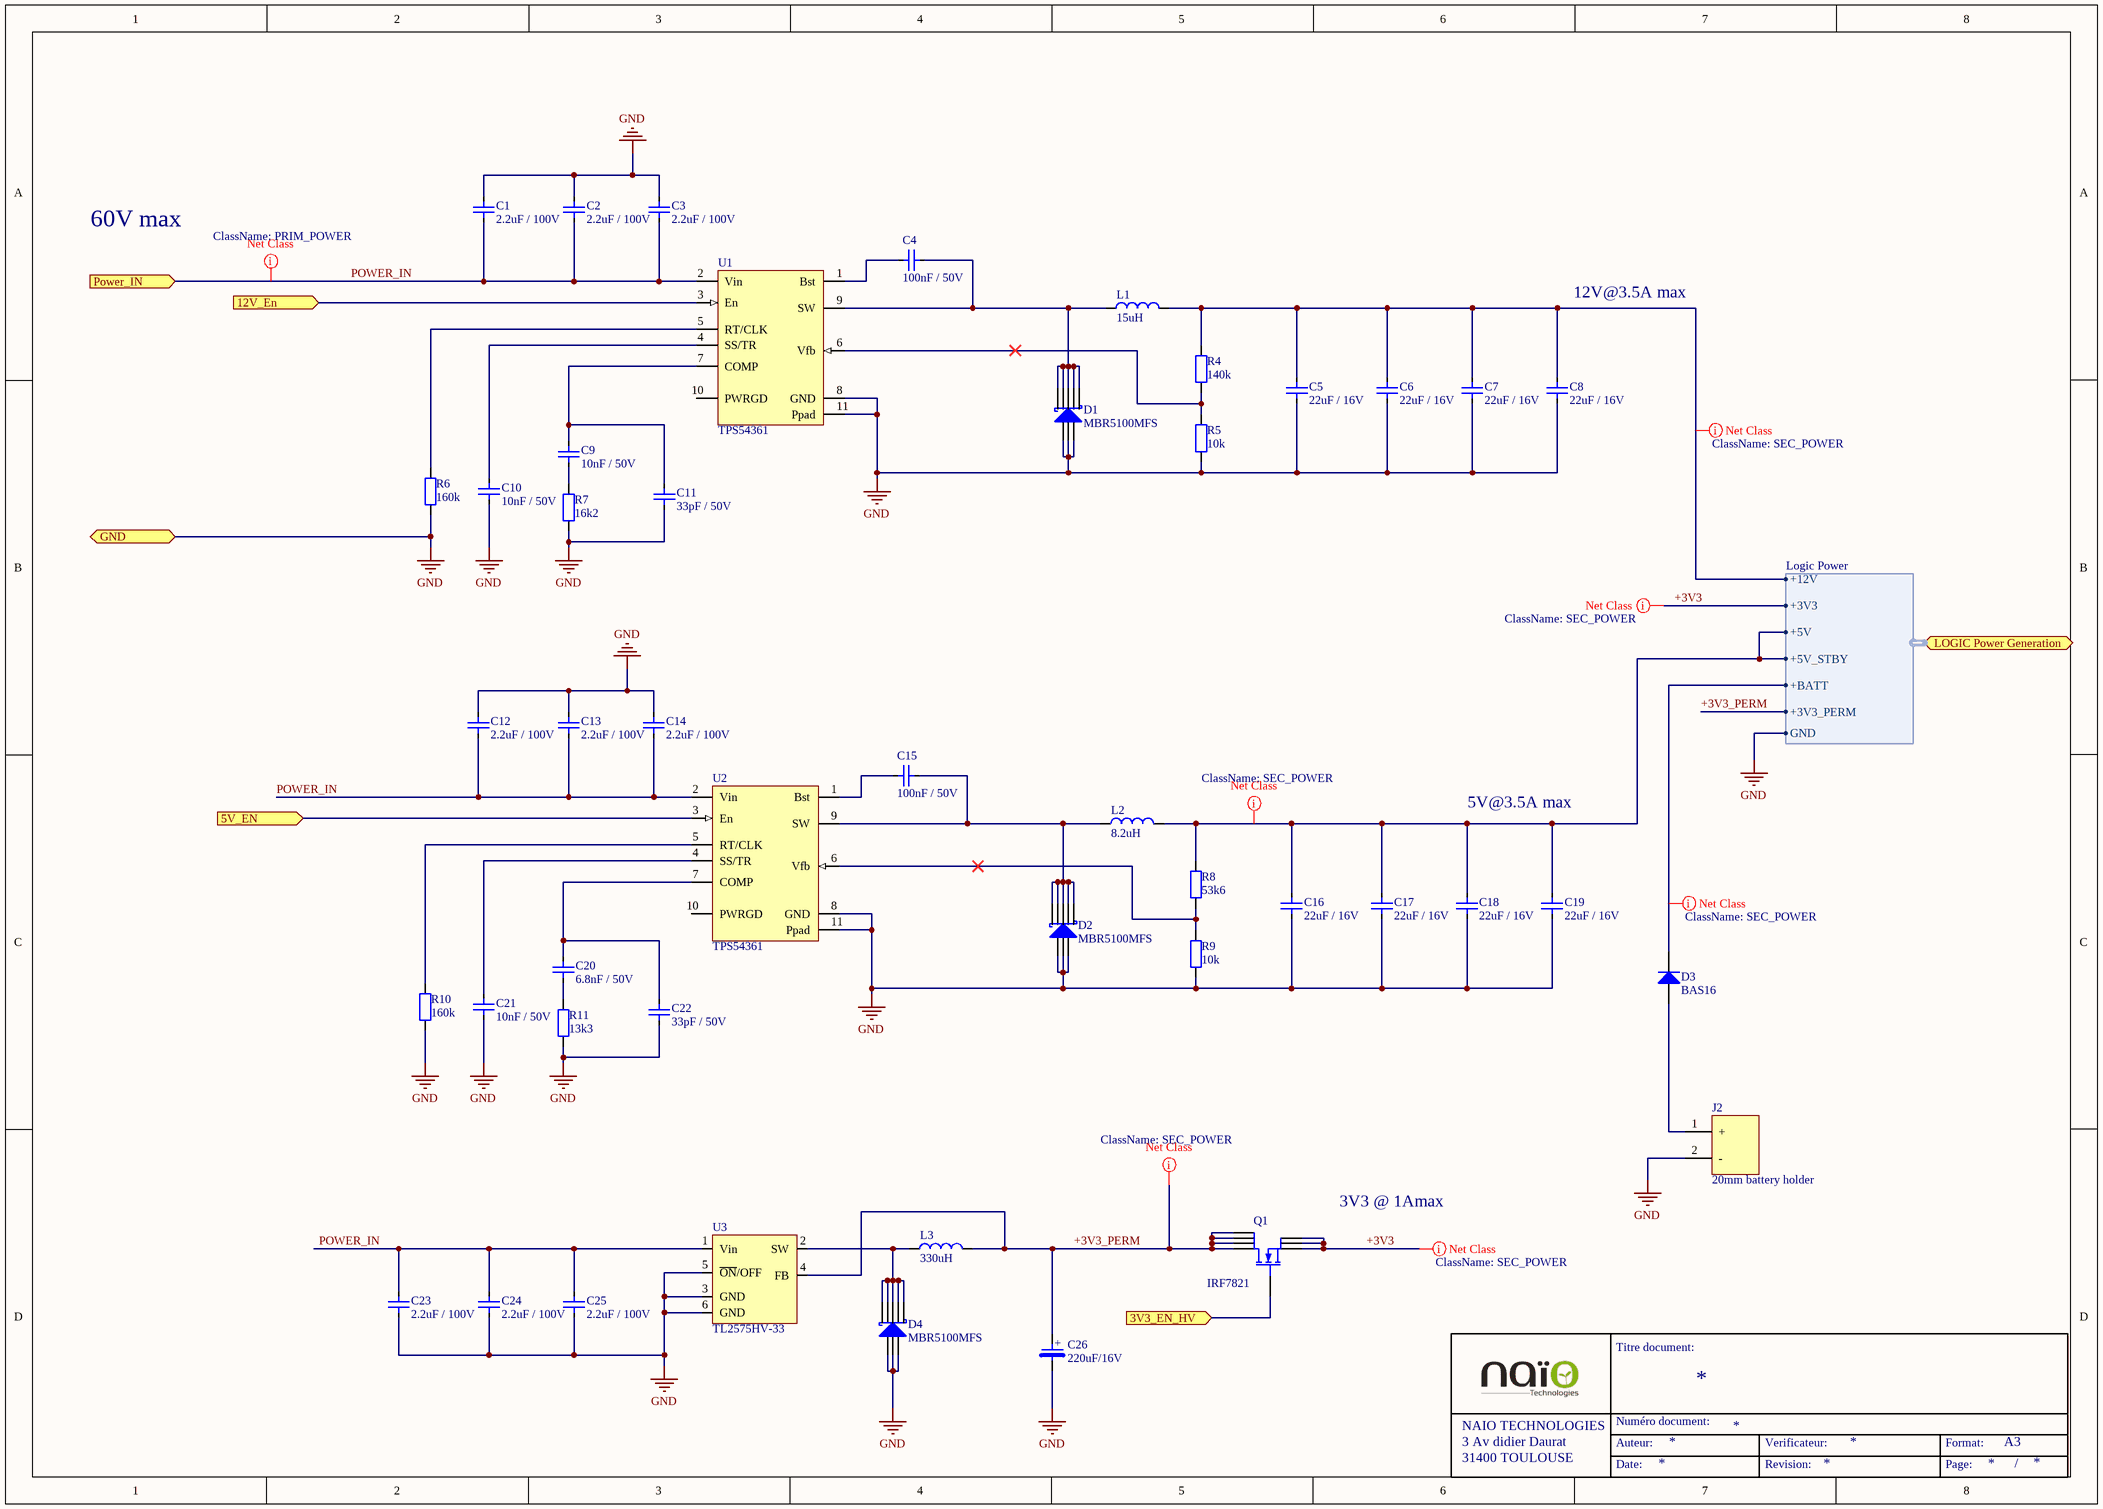
[diagram p2: OZ440-SE100-CAR003_sheet3.SchDoc]

### Parts
C1  Displayed reference: 2.2uF / 100V  [C1206-STD]  (hidden comment: CAP-SMD)
C2  Displayed reference: 2.2uF / 100V  [C1206-STD]  (hidden comment: CAP-SMD)
C3  Displayed reference: 2.2uF / 100V  [C1206-STD]  (hidden comment: CAP-SMD)
C4  Displayed reference: 100nF / 50V  [C0805-STD]  (hidden comment: CAP-SMD)
C5  Displayed reference: 22uF / 16V  [C1210-STD]  (hidden comment: CAP-SMD)
C6  Displayed reference: 22uF / 16V  [C1210-STD]  (hidden comment: CAP-SMD)
C7  Displayed reference: 22uF / 16V  [C1210-STD]  (hidden comment: CAP-SMD)
C8  Displayed reference: 22uF / 16V  [C1210-STD]  (hidden comment: CAP-SMD)
C9  Displayed reference: 10nF / 50V  [C0805-STD]  (hidden comment: CAP-SMD)
C10  Displayed reference: 10nF / 50V  [C0805-STD]  (hidden comment: CAP-SMD)
C11  Displayed reference: 33pF / 50V  [C0805-STD]  (hidden comment: CAP-SMD)
C12  Displayed reference: 2.2uF / 100V  [C1206-STD]  (hidden comment: CAP-SMD)
C13  Displayed reference: 2.2uF / 100V  [C1206-STD]  (hidden comment: CAP-SMD)
C14  Displayed reference: 2.2uF / 100V  [C1206-STD]  (hidden comment: CAP-SMD)
C15  Displayed reference: 100nF / 50V  [C0805-STD]  (hidden comment: CAP-SMD)
C16  Displayed reference: 22uF / 16V  [C1210-STD]  (hidden comment: CAP-SMD)
C17  Displayed reference: 22uF / 16V  [C1210-STD]  (hidden comment: CAP-SMD)
C18  Displayed reference: 22uF / 16V  [C1210-STD]  (hidden comment: CAP-SMD)
C19  Displayed reference: 22uF / 16V  [C1210-STD]  (hidden comment: CAP-SMD)
C20  Displayed reference: 6.8nF / 50V  [C0805-STD]  (hidden comment: CAP-SMD)
C21  Displayed reference: 10nF / 50V  [C0805-STD]  (hidden comment: CAP-SMD)
C22  Displayed reference: 33pF / 50V  [C0805-STD]  (hidden comment: CAP-SMD)
C23  Displayed reference: 2.2uF / 100V  [C1206-STD]  (hidden comment: CAP-SMD)
C24  Displayed reference: 2.2uF / 100V  [C1206-STD]  (hidden comment: CAP-SMD)
C25  Displayed reference: 2.2uF / 100V  [C1206-STD]  (hidden comment: CAP-SMD)
C26  Displayed reference: 220uF/16V  [CAP-ELECTRO-SMD]  (hidden comment: CAP-POL-SMD)
D1  Displayed reference: MBR5100MFS  [SO8-SPE-MBR5100MFS]  (hidden comment: MBR5100MFS-SO8)
D2  Displayed reference: MBR5100MFS  [SO8-SPE-MBR5100MFS]  (hidden comment: MBR5100MFS-SO8)
D3  Displayed reference: BAS16  [SOT23-STD]  (hidden comment: BAS16-SOT23)
D4  Displayed reference: MBR5100MFS  [SO8-SPE-MBR5100MFS]  (hidden comment: MBR5100MFS-SO8)
J2  Displayed reference: 20mm battery holder  [CONN-SPE-Keyst_1081]  (hidden comment: CONN-STD-2P_BATTERY)
L1  Displayed reference: 15uH  [L-SPE-XAL60xx]  (hidden comment: IND-SMD)
L2  Displayed reference: 8.2uH  [L-SPE-XAL60xx]  (hidden comment: IND-SMD)
L3  Displayed reference: 330uH  [L-SPE-MSS1260]  (hidden comment: IND-SMD)
Q1  Displayed reference: IRF7821  [SO8-SPE-IRF7832]  (hidden comment: IRF7832-SO8)
R4  Displayed reference: 140k  [R0805-STD]  (hidden comment: RES-SMD)
R5  Displayed reference: 10k  [R0805-STD]  (hidden comment: RES-SMD)
R6  Displayed reference: 160k  [R0805-STD]  (hidden comment: RES-SMD)
R7  Displayed reference: 16k2  [R0805-STD]  (hidden comment: RES-SMD)
R8  Displayed reference: 53k6  [R0805-STD]  (hidden comment: RES-SMD)
R9  Displayed reference: 10k  [R0805-STD]  (hidden comment: RES-SMD)
R10  Displayed reference: 160k  [R0805-STD]  (hidden comment: RES-SMD)
R11  Displayed reference: 13k3  [R0805-STD]  (hidden comment: RES-SMD)
U1  Displayed reference: TPS54361  [SON10-SPE-TPS54361]  (hidden comment: TPS54361-SON10)
U2  Displayed reference: TPS54361  [SON10-SPE-TPS54361]  (hidden comment: TPS54361-SON10)
U3  Displayed reference: TL2575HV-33  [TO263-5-SPE-TL2575HV]  (hidden comment: TL2575HV-xx-TO263)

### Ports
3V3_EN_HV (in), 5V_EN (in), 12V_En (in), GND, LOGIC Power Generation (harness Logic Power), Power_IN (in)

### Harnesses
Logic Power: +12V, +3V3, +5V, +5V_STBY, +BATT, GND, +3V3_PERM

### Nets
+3V3: Q1.1(S) Q1.2(S) Q1.3(S) ; port LOGIC Power Generation.+3V3
+3V3_PERM: C26.1 L3.2 Q1.5(D) Q1.6(D) Q1.7(D) Q1.8(D) U3.4(FB) ; port LOGIC Power Generation.+3V3_PERM
+5V: C16.2 C17.2 C18.2 C19.2 L2.2 R8.2 ; port LOGIC Power Generation.+5V, port LOGIC Power Generation.+5V_STBY
GND: C1.2 C2.2 C3.2 C5.1 C6.1 C7.1 C8.1 C10.1 C11.1 C12.2 C13.2 C14.2 C16.1 C17.1 C18.1 C19.1 C21.1 C22.1 C23.1 C24.1 C25.1 C26.2 D1.1(A) D1.2(A) D1.3(A) D2.1(A) D2.2(A) D2.3(A) D4.1(A) D4.2(A) D4.3(A) J2.2(-) R5.1 R6.2 R7.1 R9.1 R10.2 R11.1 U1.8(GND) U1.11(Ppad) U2.8(GND) U2.11(Ppad) U3.3(GND) U3.5(~{ON}/OFF) U3.6(GND) ; port GND, port LOGIC Power Generation.GND  [project net Logic_Power.GND]
5V_EN: U2.3(En) ; port 5V_EN
12V_EN: U1.3(En) ; port 12V_En
+12V: C5.2 C6.2 C7.2 C8.2 L1.2 R4.2 ; port LOGIC Power Generation.+12V
+BATT: D3.3(K) ; port LOGIC Power Generation.+BATT
POWER_IN: C1.1 C2.1 C3.1 C12.1 C13.1 C14.1 C23.2 C24.2 C25.2 U1.2(Vin) U2.2(Vin) U3.1(Vin) ; port Power_IN
NetC4_1: C4.1 U1.1(Bst)
NetC4_2: C4.2 D1.5(K) D1.6(K) D1.7(K) D1.8(K) L1.1 U1.9(SW)
NetC9_1: C9.1 R7.2
NetC9_2: C9.2 C11.2 U1.7(COMP)
NetC10_2: C10.2 U1.4(SS/TR)
NetC15_1: C15.1 U2.1(Bst)
NetC15_2: C15.2 D2.5(K) D2.6(K) D2.7(K) D2.8(K) L2.1 U2.9(SW)
NetC20_1: C20.1 R11.2
NetC20_2: C20.2 C22.2 U2.7(COMP)
NetC21_2: C21.2 U2.4(SS/TR)
NetD3_1: D3.1(A) J2.1(+)
NetD4_5: D4.5(K) D4.6(K) D4.7(K) D4.8(K) L3.1 U3.2(SW)
NetQ1_4: Q1.4(G) ; port 3V3_EN_HV
NetR4_1: R4.1 R5.2 U1.6(Vfb)
NetR6_1: R6.1 U1.5(RT/CLK)
NetR8_1: R8.1 R9.2 U2.6(Vfb)
NetR10_1: R10.1 U2.5(RT/CLK)

Not connected (* = marked no-connect by the designer): U1 10(PWRGD); U2 10(PWRGD)

### Layout directives
net class PRIM_POWER: POWER_IN
net class SEC_POWER: +3V3, +3V3_PERM, +5V, +12V, +BATT

### Notes on the sheet
- 60V max
- 12V@3.5A max
- 5V@3.5A max
- 3V3 @ 1Amax
- Titre document:
- NAIO TECHNOLOGIES
- 3 Av didier Daurat
- 31400 TOULOUSE
- Auteur:
- Numéro document:
- Verificateur:
- Format:
- A3
- Date:
- Revision:
- Page:
- /
- (in symbol B41142A4227M) +

### Library data of the parts
C1-C3 C12-C14 C23-C25 = C3216X7S2A225Kxxx: 1206 2.2uF / 100V X7S ceramic capacitor; Manufacturer: TDK; Max Voltage: 100; Tolerance: +/- 10%; Validated: N; Reference: C3216X7S2A225Kxxx; Value: 2.2uF; Material: X7S; Footprint description: standard Capacitor 1206; Pin Count: 2; helpURL: http://www.mouser.com/ds/2/400/C3216X7S2A225K160AB-265429.pdf; Supplier 1: Mouser; Supplier Part Number 1: 810-C3216X7S2A225K; Supplier 2: Farnell; Supplier Part Number 2: 2112717
C4 C15 = VJ0805Y104KXAxx: 0805 100nF / 50V  X7R ceramic capacitor; Manufacturer: vishay; Max Voltage: 50; Tolerance: +/- 10%; Validated: N; Reference: VJ0805Y104KXAxx; Value: 100nF; Material: X7R; Footprint description: standard Capacitor 0805; Pin Count: 2; helpURL: http://www.vishay.com/docs/45200/highrels.pdf; Supplier 1: Farnell; Supplier Part Number 1: 1612208; Supplier 2: Digi-Key; Supplier Part Number 2: 720-1266-6-ND
C5-C8 C16-C19 = 1210YC226KAT2A: 1210 22uF / 16V X7R ceramic capacitor; Manufacturer: AVX; Value: 100uF; Max Voltage: 16; Tolerance: +/- 10%; Validated: N; Reference: 1210YC226KAT2A; Material: X7R; Footprint description: standard Capacitor 1210; Pin Count: 2; helpURL: http://www.farnell.com/datasheets/84526.pdf; Supplier 1: Farnell; Supplier Part Number 1: 1657948; Supplier 2: Digi-Key; Supplier Part Number 2: 478-5729-1-ND
C9 C10 C21 = VJ0805Y103KXAxx: 0805 10nF / 50V X7R ceramic capacitor; Manufacturer: vishay; Max Voltage: 50; Tolerance: +/- 10%; Validated: N; Reference: VJ0805Y103KXAxx; Value: 10nF; Material: X7R; Footprint description: standard Capacitor 0805; Pin Count: 2; helpURL: http://www.vishay.com/docs/45200/highrels.pdf; Supplier 1: Farnell; Supplier Part Number 1: 1650952; Supplier 2: Digi-Key; Supplier Part Number 2: BC1293CT-ND
C11 C22 = C0805C330J5GACxx: 0805 33pF / 50V COG ceramic capacitor; Manufacturer: Kemet; Max Voltage: 50; Tolerance: +/- 10%; Validated: False; Reference: C0805C330J5GACxx; Value: 33pF; Material: COG; Footprint description: standard Capacitor 0805; Pin Count: 2; helpURL: http://www.farnell.com/datasheets/40863.pdf; Supplier 1: Mouser; Supplier Part Number 1: 80-C0805C330J5GACTM; Supplier 2: Farnell; Supplier Part Number 2: 1414685
C20 = C0805C682J5GACxx: 0805 6.8nF / 50V COG ceramic capacitor; Manufacturer: Kemet; Max Voltage: 50; Tolerance: +/- 5%; Validated: N; Reference: C0805C682J5GACxx; Value: 6.8nF; Material: COG; Footprint description: standard Capacitor 0805; Pin Count: 2; helpURL: http://www.farnell.com/datasheets/40863.pdf; Supplier 1: Mouser; Supplier Part Number 1: 80-C0805C682J5G; Supplier 2: Farnell; Supplier Part Number 2: 1535571
C26 = B41142A4227M: 220uF/16V Aluminium capacitor SMD; Manufacturer: Epcos; Value: 220uF; Max Voltage: 16V; Reference: B41142A4227M; Material: Aluminium; Footprint description: 6.3mm x 7.7mm; Pin Count: 2; helpURL: www.epcos.com/inf/20/30/db/alu_x/B41142.pdf; Supplier 1: Farnell; Supplier Part Number 1: 1735331; Supplier 2: Mouser; Supplier Part Number 2: 871-B41142A4227M
D1 D2 D4 = MBR5100MFS: Power shottky Diode; Manufacturer: ON semi; Max Voltage: 100; Max Current: 5A; Validated: False; Reference: MBR5100MFS; component type: Schottky diode; Footprint description: SO8 Flat lead; Pin Count: 10; Rev: D; helpURL: http://www.onsemi.com/pub_link/Collateral/MBR5100MFS-D.PDF; Supplier 1: Mouser; Supplier Part Number 1: 863-MBR5100MFST1G; Supplier 2: Digi-Key; Supplier Part Number 2: MBR5100MFST3G-ND
D3 = BAS16: 100V / 120mA signal  diode; Manufacturer: NXP; Max Voltage: 100; Max Current: 0.2A; Validated: False; Reference: BAS16; component type: DIODE; Footprint description: Sot23 SMD package; Pin Count: 3; Rev: 2010; helpURL: http://www.nxp.com/documents/data_sheet/BAS16_SER.pdf; Supplier 1: Farnell; Supplier Part Number 1: 1081180; Supplier 2: Digi-Key; Supplier Part Number 2: 568-1596-1-ND
J2 = 1081: 20mm battery Holder, SMT; Manufacturer: Keystone; Reference: 1081; Validated: False; Material: HT nylon; Footprint description: 20mm SMT battery holder; Pin Count: 2; Rev: A; helpURL: http://www.keyelco.com/product.cfm/Surface-Mount/1081/p/404/id/406/c_id/992/product_id/731; Supplier 1: Farnell; Supplier Part Number 1: 1888399; Supplier 2: Mouser; Supplier Part Number 2: 534-1081
L1 = XAL6060-153ME: 15uH SMD inductor; Manufacturer: COILCRAFT; Max Current: 6A; Frequency band: 11Mhz; Validated: False; Reference: XAL6060-153ME; Value: 15uH; Footprint description: SMD 2 pin; Pin Count: 2; Rev: 11/20/12; helpURL: http://www.coilcraft.com/pdfs/xal60xx.pdf; Supplier 1: Mouser; Supplier Part Number 1: 994-XAL6060-153MEB; Supplier 2: Farnell; Supplier Part Number 2: 2289092
L2 = XAL6060-822ME: 8.2uH SMD inductor; Manufacturer: COILCRAFT; Max Current: 8A; Frequency band: 16Mhz; Validated: False; Reference: XAL6060-822ME; Value: 8.2uH; Footprint description: SMD 2 pin; Pin Count: 2; Rev: 11/20/12; helpURL: http://www.coilcraft.com/pdfs/xal60xx.pdf; Supplier 1: Mouser; Supplier Part Number 1: 994-XAL6060-822MEB; Supplier 2: Farnell; Supplier Part Number 2: 2289089
L3 = MSS1260-334KL: 330uH SMD inductor; Manufacturer: COILCRAFT; Max Current: 1.16A; Frequency band: 4Mhz; Validated: False; Reference: MSS1260-334KL; Value: 330uH; Footprint description: SMD 2 pin; Pin Count: 2; Rev: 10/31/11; helpURL: http://www.coilcraft.com/pdfs/mss1260.pdf; Supplier 1: Mouser; Supplier Part Number 1: 994-MSS1260-334KLB; Supplier 2: Farnell; Supplier Part Number 2: 2288413RL
Q1 = IRF7821PBF: 11A N channel MOSFET in SO08 package; Manufacturer: IRF; Max Voltage: 30V; Rated Power: 2.5W; Validated: False; Reference: IRF7821PBF; component type: NMOS; Max Current: 11A; Footprint description: SO08; Pin Count: 8; Rev: 30/06/05; helpURL: http://www.irf.com/product-info/datasheets/data/irf7821.pdf; Supplier 1: Farnell; Supplier Part Number 1: 1013495; Supplier 2: Digi-Key; Supplier Part Number 2: IRF7821PBFCT-ND
R4 = CRCW0805140KFKxx: 140k Ohm 0805 SMD resistor; Manufacturer: Vishay; Value: 140 000; Tolerance: 1%; Rated Power: 0.125W; Validated: False; Reference: CRCW0805140KFKxx; Footprint description: standard 0805 SMD; Pin Count: 2; helpURL: http://www.vishay.com/docs/20035/dcrcwe3.pdf; Supplier 1: Mouser; Supplier Part Number 1: 71-CRCW0805-140K-E3; Supplier 2: Farnell; Supplier Part Number 2: 1260846
R5 R9 = CRCW080510K0FKxx: as R1 on sheet OZ440-SE100-CAR003_Sheet2; Reference: CRCW080510K0FKxx; Footprint description: standard 0805 SMD; Pin Count: 2; helpURL: http://www.vishay.com/docs/20035/dcrcwe3.pdf; Supplier 1: Farnell; Supplier Part Number 1: 1469856; Supplier 2: Mouser; Supplier Part Number 2: 71-CRCW0805-10K-E3
R6 R10 = CRCW0805160KFKxx: 160k Ohm 0805 SMD resistor; Manufacturer: Vishay; Value: 160 000; Tolerance: 1%; Rated Power: 0.125W; Validated: False; Reference: CRCW0805160KFKxx; Footprint description: standard 0805 SMD; Pin Count: 2; helpURL: http://www.vishay.com/docs/20035/dcrcwe3.pdf; Supplier 1: Farnell; Supplier Part Number 1: 1246882; Supplier 2: Mouser; Supplier Part Number 2: 71-CRCW0805160KFKEA
R7 = CRCW080516K2FKxx: 16k2 Ohm 0805 SMD resistor; Manufacturer: Vishay; Value: 16200; Tolerance: 1%; Rated Power: 0.125W; Validated: No; Reference: CRCW080516K2FKxx; Footprint description: standard 0805 SMD; Pin Count: 2; helpURL: http://www.vishay.com/docs/20035/dcrcwe3.pdf; Supplier 1: Mouser; Supplier Part Number 1: 71-CRCW0805-16.2K-E3; Supplier 2: Farnell; Supplier Part Number 2: 1469878
R8 = CRCW080553K6FKxx: 53k6 Ohm 0805 SMD resistor; Manufacturer: Vishay; Value: 53600; Tolerance: 1%; Rated Power: 0.125W; Validated: No; Reference: CRCW080553K6FKxx; Footprint description: standard 0805 SMD; Pin Count: 2; helpURL: http://www.vishay.com/docs/20035/dcrcwe3.pdf; Supplier 1: Mouser; Supplier Part Number 1: 71-CRCW080553K6FKEA; Supplier 2: Farnell; Supplier Part Number 2: 1185098
R11 = CRCW080513K3FKxx: 13k3 Ohm 0805 SMD resistor; Manufacturer: Vishay; Value: 13 300; Tolerance: 1%; Rated Power: 0.125W; Validated: No; Reference: CRCW080513K3FKxx; Footprint description: standard 0805 SMD; Pin Count: 2; helpURL: http://www.vishay.com/docs/20035/dcrcwe3.pdf; Supplier 1: Mouser; Supplier Part Number 1: 71-CRCW0805-13.3K-E3; Supplier 2: Farnell; Supplier Part Number 2: 1260840
U1 U2 = TPS54361DPRx: 4.5-V to 60-V Input, 3.5-A, Step Down DC-DC Converter; Manufacturer: TI; Max Voltage: 60V; Max Current: 3.5A; Validated: False; Reference: TPS54361DPRx; Footprint description: SON10 SMD package; Pin Count: 10; Rev: 12/2013; helpURL: http://www.ti.com/lit/ds/symlink/tps54361.pdf; Supplier 1: Farnell; Supplier Part Number 1: 2392482; Supplier 2: Digi-Key; Supplier Part Number 2: 296-37248-6-ND
U3 = TL2575HV-33-Q1: 1-A SIMPLE STEP-DOWN VOLTAGE REGULATOR; Manufacturer: TI; Max Voltage: 60; Max Current: 1; Validated: False; Reference: TL2575HV-33-Q1; Footprint description: D2PAK 5 pin; Pin Count: 6; Rev: 09/10; helpURL: http://www.ti.com/lit/ds/symlink/tl2575hv-05-q1.pdf; Supplier 1: Mouser; Supplier Part Number 1: 595-L2575HV33QKTTRQ1; Supplier 2: Digi-Key; Supplier Part Number 2: 296-36739-1-ND

## Sheet OZ440-SE100-CAR003_sheet4.SchDoc
size A3
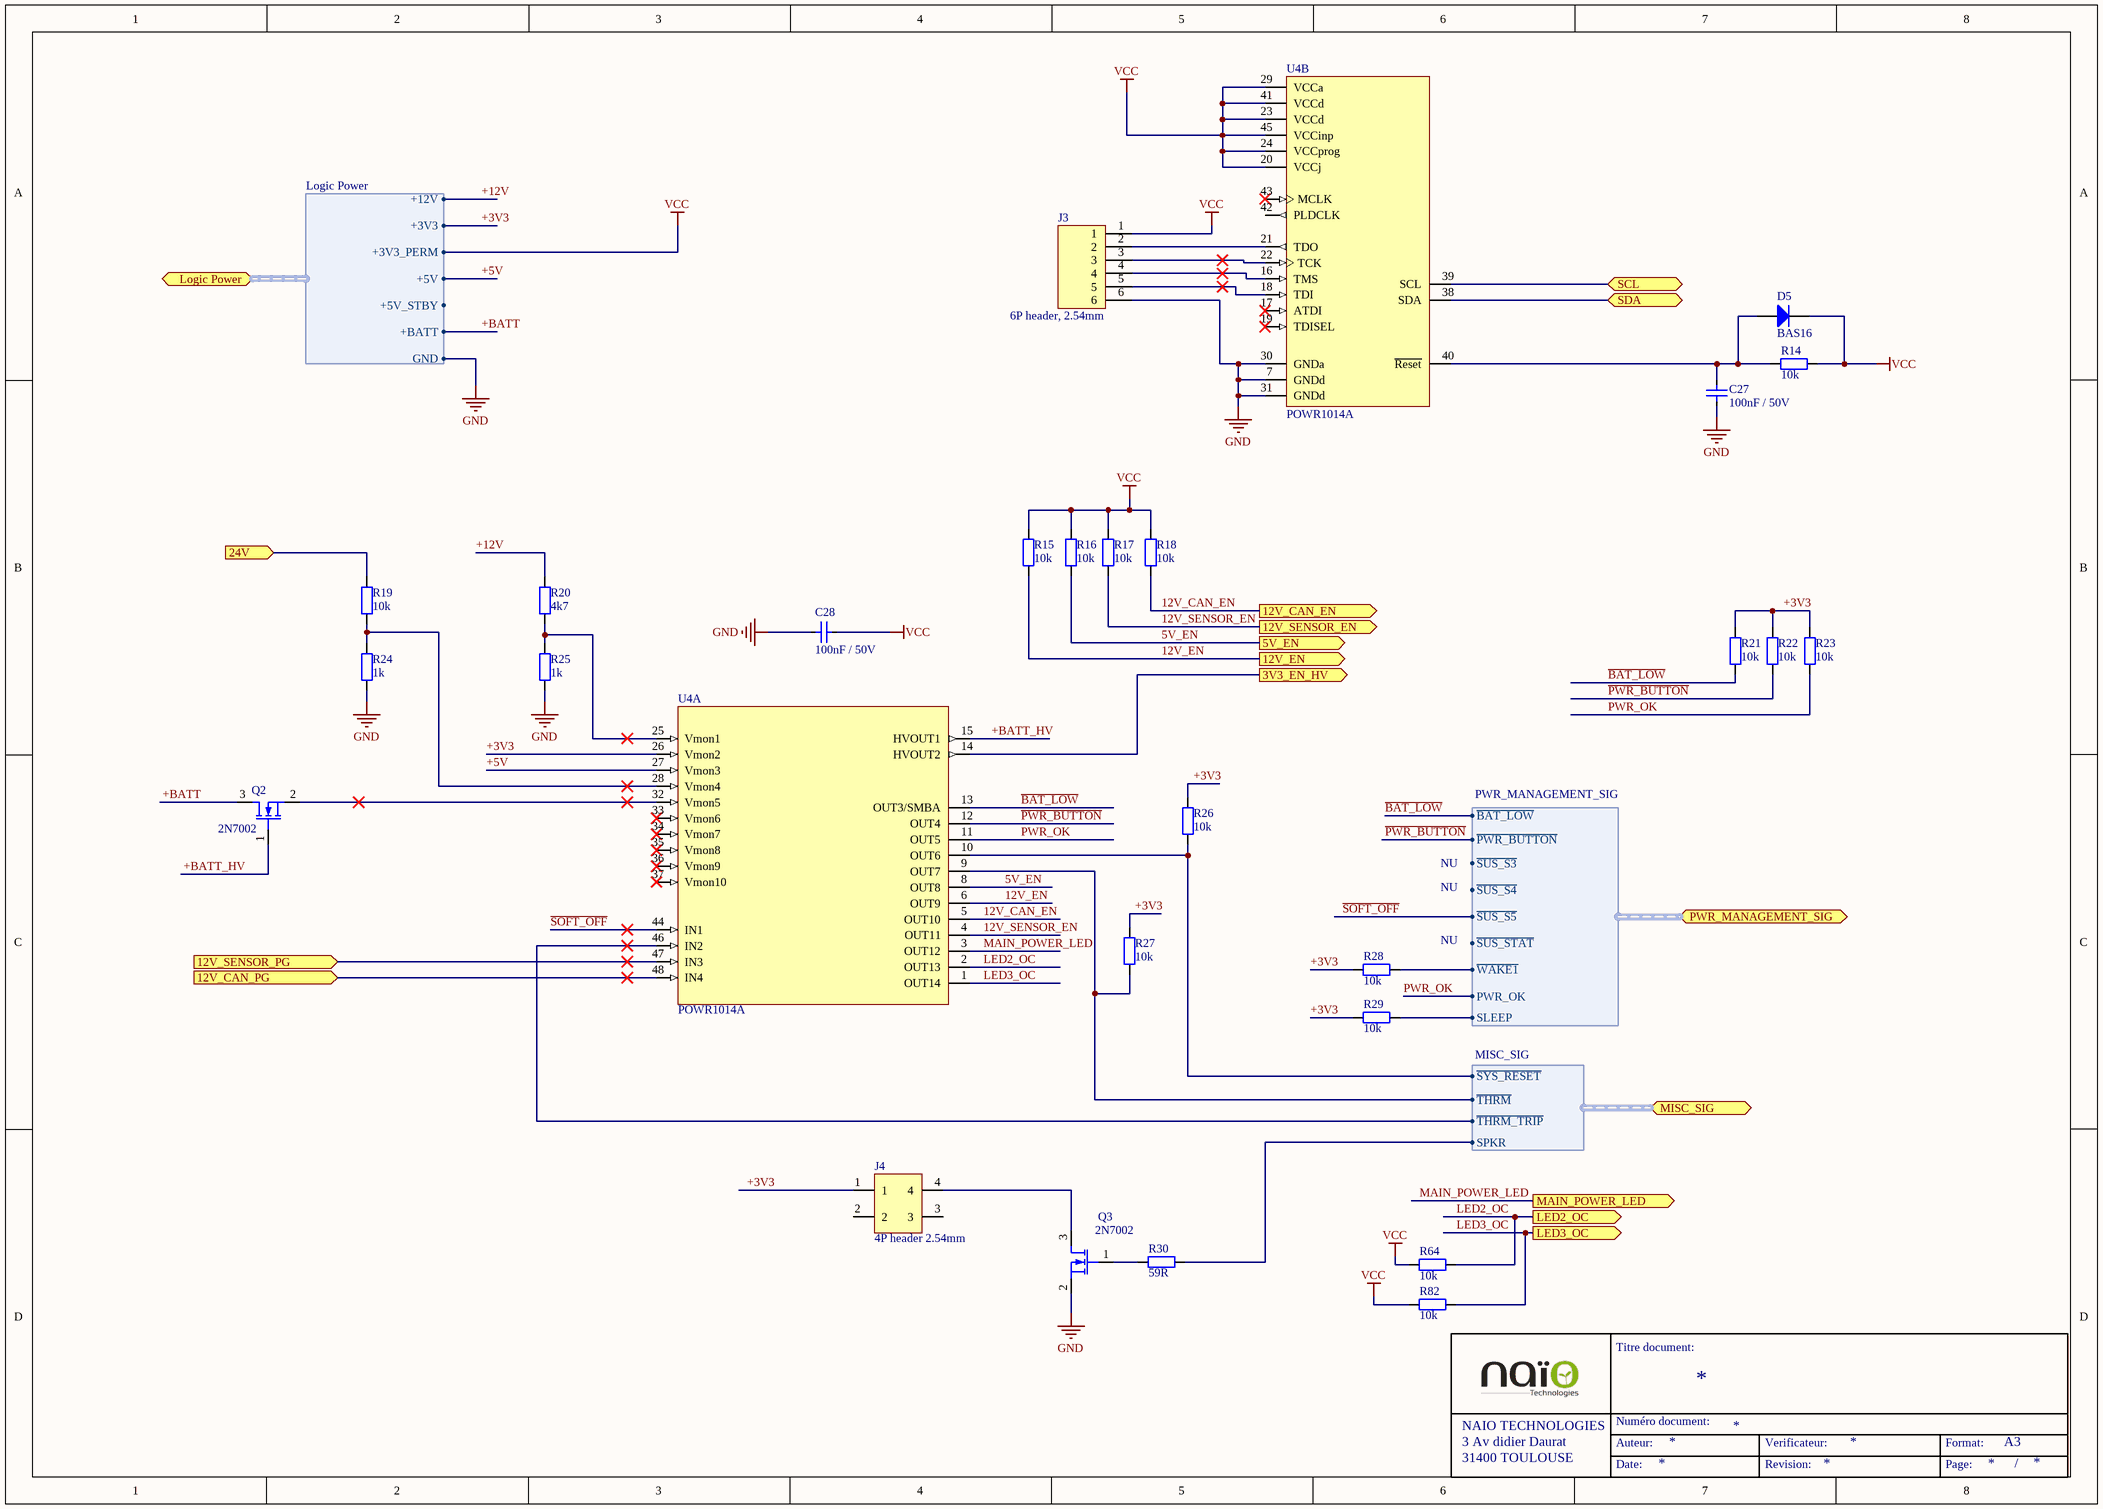
[diagram p3: OZ440-SE100-CAR003_sheet4.SchDoc]

### Parts
C27  Displayed reference: 100nF / 50V  [C0805-STD]  (hidden comment: CAP-SMD)
C28  Displayed reference: 100nF / 50V  [C0805-STD]  (hidden comment: CAP-SMD)
D5  Displayed reference: BAS16  [SOT23-STD]  (hidden comment: BAS16-SOT23)
J3  Displayed reference: 6P header, 2.54mm  [6P_HEADER-STD_TH_1ROW]  (hidden comment: CONN-STD-6P_1ROW)
J4  Displayed reference: 4P header 2.54mm  [4P_HEADER-SPE-1241050-2]  (hidden comment: CONN-STD-4P_2ROW)
Q2  Displayed reference: 2N7002  [SOT23-SPE-2N7002]  (hidden comment: 2N7002-SMD3P)
Q3  Displayed reference: 2N7002  [SOT23-SPE-2N7002]  (hidden comment: 2N7002-SMD3P)
R14  Displayed reference: 10k  [R0805-STD]  (hidden comment: RES-SMD)
R15  Displayed reference: 10k  [R0805-STD]  (hidden comment: RES-SMD)
R16  Displayed reference: 10k  [R0805-STD]  (hidden comment: RES-SMD)
R17  Displayed reference: 10k  [R0805-STD]  (hidden comment: RES-SMD)
R18  Displayed reference: 10k  [R0805-STD]  (hidden comment: RES-SMD)
R19  Displayed reference: 10k  [R0805-STD]  (hidden comment: RES-SMD)
R20  Displayed reference: 4k7  [R0805-STD]  (hidden comment: RES-SMD)
R21  Displayed reference: 10k  [R0805-STD]  (hidden comment: RES-SMD)
R22  Displayed reference: 10k  [R0805-STD]  (hidden comment: RES-SMD)
R23  Displayed reference: 10k  [R0805-STD]  (hidden comment: RES-SMD)
R24  Displayed reference: 1k  [R0805-STD]  (hidden comment: RES-SMD)
R25  Displayed reference: 1k  [R0805-STD]  (hidden comment: RES-SMD)
R26  Displayed reference: 10k  [R0805-STD]  (hidden comment: RES-SMD)
R27  Displayed reference: 10k  [R0805-STD]  (hidden comment: RES-SMD)
R28  Displayed reference: 10k  [R0805-STD]  (hidden comment: RES-SMD)
R29  Displayed reference: 10k  [R0805-STD]  (hidden comment: RES-SMD)
R30  Displayed reference: 59R  [R0805-STD]  (hidden comment: RES-SMD)
R64  Displayed reference: 10k  [R0805-STD]  (hidden comment: RES-SMD)
R82  Displayed reference: 10k  [R0805-STD]  (hidden comment: RES-SMD)
U4  Displayed reference: POWR1014A  [TQFP48-SPE-PWR1014]  (hidden comment: PWR1014A-TQFP48)  (parts A,B of 2)

### Ports
3V3_EN_HV (out), 5V_EN (out), 12V_CAN_EN (out), 12V_CAN_PG (in), 12V_EN (out), 12V_SENSOR_EN (out), 12V_SENSOR_PG (in), 24V (in), LED2_OC (out), LED3_OC (out), Logic Power (harness Logic Power), MAIN_POWER_LED (out), MISC_SIG (harness MISC_SIG), PWR_MANAGEMENT_SIG (harness PWR_MANAGEMENT_SIG), SCL, SDA

### Harnesses
Logic Power: +12V, +3V3, +3V3_PERM, +5V, +5V_STBY, +BATT, GND
PWR_MANAGEMENT_SIG: ~{BAT_LOW}, ~{PWR_BUTTON}, ~{SUS_S3}, ~{SUS_S4}, ~{SUS_S5}, ~{SUS_STAT}, ~{WAKE1}, PWR_OK, SLEEP
MISC_SIG: ~{SYS_RESET}, ~{THRM}, ~{THRM_TRIP}, SPKR

### Nets
+3V3: J4.1 R21.1 R22.1 R23.1 R26.1 R27.1 R28.2 R29.2 U4.26(Vmon2) ; port Logic Power.+3V3
+5V: U4.27(Vmon3) ; port Logic Power.+5V, port Logic Power.+5V_STBY
GND: C27.1 C28.1 J3.6 Q3.2(S) R24.1 R25.1 U4.7(GNDd) U4.30(GNDa) U4.31(GNDd) ; port Logic Power.GND  [project net Logic_Power.GND]
VCC: C28.2 D5.3(K) J3.1 R14.1 R15.1 R16.1 R17.1 R18.1 R64.2 R82.2 U4.20(VCCj) U4.23(VCCd) U4.24(VCCprog) U4.29(VCCa) U4.41(VCCd) U4.45(VCCinp) ; port Logic Power.+3V3_PERM  [project net +3V3_PERM]
5V_EN: R16.2 U4.8(OUT8) ; port 5V_EN
12V_CAN_EN: R18.2 U4.5(OUT10) ; port 12V_CAN_EN
12V_CAN_PG: U4.48(IN4) ; port 12V_CAN_PG
12V_EN: R15.2 U4.6(OUT9) ; port 12V_EN
12V_SENSOR_EN: R17.2 U4.4(OUT11) ; port 12V_SENSOR_EN
+12V: R20.2 ; port Logic Power.+12V
+BATT: Q2.3(D) ; port Logic Power.+BATT
+BATT_HV: Q2.1(G) U4.15(HVOUT1)
~{BAT_LOW}: R21.2 U4.13(OUT3/SMBA) ; port PWR_MANAGEMENT_SIG.~{BAT_LOW}
~{PWR_BUTTON}: R22.2 U4.12(OUT4) ; port PWR_MANAGEMENT_SIG.~{PWR_BUTTON}
~{SOFT_OFF}: U4.44(IN1) ; port PWR_MANAGEMENT_SIG.~{SUS_S5}
~{SYS_RESET}: R26.2 U4.10(OUT6) ; port MISC_SIG.~{SYS_RESET}
~{THRM}: R27.2 U4.9(OUT7) ; port MISC_SIG.~{THRM}
~{THRM_TRIP}: U4.46(IN2) ; port MISC_SIG.~{THRM_TRIP}
~{WAKE1}: R28.1 ; port PWR_MANAGEMENT_SIG.~{WAKE1}
I2C_PWR.SMB_CK: U4.39(SCL) ; port SCL
I2C_PWR.SMB_DAT: U4.38(SDA) ; port SDA
LED2_OC: R64.1 U4.2(OUT13) ; port LED2_OC
LED3_OC: R82.1 U4.1(OUT14) ; port LED3_OC
MAIN_POWER_LED: U4.3(OUT12) ; port MAIN_POWER_LED
MISC_SIG.SPKR: R30.2 ; port MISC_SIG.SPKR
POWER_IN: R19.2 ; port 24V
PWR_OK: R23.2 U4.11(OUT5) ; port PWR_MANAGEMENT_SIG.PWR_OK
SLEEP: R29.1 ; port PWR_MANAGEMENT_SIG.SLEEP
NetC27_2: C27.2 D5.1(A) R14.2 U4.40(~{Reset})
NetJ3_2: J3.2 U4.21(TDO)
NetJ3_3: J3.3 U4.22(TCK)
NetJ3_4: J3.4 U4.16(TMS)
NetJ3_5: J3.5 U4.18(TDI)
NetJ4_4: J4.4 Q3.3(D)
NetQ1_4: U4.14(HVOUT2) ; port 3V3_EN_HV
NetQ2_2: Q2.2(S) U4.32(Vmon5)
NetQ3_1: Q3.1(G) R30.1
NetR19_1: R19.1 R24.2 U4.28(Vmon4)
NetR20_1: R20.1 R25.2 U4.25(Vmon1)
NetR42_2: U4.47(IN3) ; port 12V_SENSOR_PG

Not connected (* = marked no-connect by the designer): J4 2 3; U4 17(ATDI)* 19(TDISEL)* 33(Vmon6)* 34(Vmon7)* 35(Vmon8)* 36(Vmon9)* 37(Vmon10)* 42(PLDCLK) 43(MCLK)*

### Notes on the sheet
- NU
- Titre document:
- NAIO TECHNOLOGIES
- 3 Av didier Daurat
- 31400 TOULOUSE
- Auteur:
- Numéro document:
- Verificateur:
- Format:
- A3
- Date:
- Revision:
- Page:
- /

### Library data of the parts
C27 C28 = VJ0805Y104KXAxx: as C4 on sheet OZ440-SE100-CAR003_sheet3; Reference: VJ0805Y104KXAxx; Value: 100nF; Material: X7R; Footprint description: standard Capacitor 0805; Pin Count: 2; helpURL: http://www.vishay.com/docs/45200/highrels.pdf; Supplier 1: Farnell; Supplier Part Number 1: 1612208; Supplier 2: Digi-Key; Supplier Part Number 2: 720-1266-6-ND
D5 = BAS16: as D3 on sheet OZ440-SE100-CAR003_sheet3; Reference: BAS16; component type: DIODE; Footprint description: Sot23 SMD package; Pin Count: 3; Rev: 2010; helpURL: http://www.nxp.com/documents/data_sheet/BAS16_SER.pdf; Supplier 1: Farnell; Supplier Part Number 1: 1081180; Supplier 2: Digi-Key; Supplier Part Number 2: 568-1596-1-ND
J3 = 68000-406HLF: 6P, 1 row, 2.54mm header; Manufacturer: FCI; Validated: False; Reference: 68000-406HLF; Footprint description: TH, 6 pin, 2.54mm; Pin Count: 6; Rev: DB; helpURL: http://portal.fciconnect.com/Comergent//fci/drawing/68000.pdf
J4 = 1241050-2: 4P, 2 rows, 2.54mm header; Manufacturer: TE CONNECTIVITY; Validated: False; Reference: 1241050-2; Footprint description: SMT 4 pins, 2 rows, 2.54mm pitch; Pin Count: 4; Rev: A9; helpURL: http://www.te.com/catalog/pn/en/1241050-2?RQPN=1241050-2; Supplier 1: Farnell; Supplier Part Number 1: 9689630
Q2 Q3 = 2N7002: N-Channel Enhancement Mode Field Effect Transistor; Manufacturer: FAIRCHILD; Max Voltage: 60 V; Max Current: 0,4 A; Rated Power: 0,2 W; Validated: False; Reference: 2N7002; component type: NMOS; Footprint description: SOT23; Pin Count: 3; Rev: A1; helpURL: http://www.fairchildsemi.com/ds/2N/2N7000.pdf; Supplier 1: Farnell; Supplier Part Number 1: 9845313; Supplier 2: Newark; Supplier Part Number 2: 58K9651
R14-R19 R21-R23 R26-R29 R64 R82 = CRCW080510K0FKxx: as R1 on sheet OZ440-SE100-CAR003_Sheet2; Reference: CRCW080510K0FKxx; Footprint description: standard 0805 SMD; Pin Count: 2; helpURL: http://www.vishay.com/docs/20035/dcrcwe3.pdf; Supplier 1: Farnell; Supplier Part Number 1: 1469856; Supplier 2: Mouser; Supplier Part Number 2: 71-CRCW0805-10K-E3
R20 = CRCW08054K70FKxx: 4,7k Ohm 0805 SMD resistor; Manufacturer: Vishay; Value: 4 700; Tolerance: 1 %; Rated Power: 0,125 W; Validated: No; Reference: CRCW08054K70FKxx; Footprint description: standard 0805 SMD; Pin Count: 2; helpURL: http://www.vishay.com/docs/20035/dcrcwe3.pdf; Supplier 1: Farnell; Supplier Part Number 1: 1469923; Supplier 2: Mouser; Supplier Part Number 2: 71-CRCW0805-4.7K-E3
R24 R25 = CRCW08051K00FKxx: 1k Ohm 0805 SMD resistor; Manufacturer: Vishay; Value: 1 000; Tolerance: 1 %; Rated Power: 0,125 W; Validated: No; Reference: CRCW08051K00FKxx; Footprint description: standard 0805 SMD; Pin Count: 2; helpURL: http://www.vishay.com/docs/20035/dcrcwe3.pdf; Supplier 1: Farnell; Supplier Part Number 1: 1469847; Supplier 2: Mouser; Supplier Part Number 2: 71-CRCW0805-1.0K-E3
R30 = CRCW080559R0FKxx: 59 Ohm 0805 SMD resistor; Manufacturer: Vishay; Value: 59; Tolerance: 1 %; Rated Power: 0.125 W; Validated: No; Reference: CRCW080559R0FKxx; Footprint description: standard 0805 SMD; Pin Count: 2; helpURL: http://www.vishay.com/docs/20035/dcrcwe3.pdf; Supplier 1: Mouser; Supplier Part Number 1: 71-CRCW080559R0FKEA; Supplier 2: Farnell; Supplier Part Number 2: 2138817
U4 = ispPAC-POWR1014A-01TN48I: ispPAC power manager; Manufacturer: LATTICE; Validated: False; Reference: ispPAC-POWR1014A-01TN48I; Footprint description: TQFP48; Pin Count: 48; Rev: 1.9; helpURL: http://www.latticesemi.com/documents/DS1014.pdf; Supplier 1: Farnell; Supplier Part Number 1: 1735242; Supplier 2: Digi-Key; Supplier Part Number 2: 220-1171-ND